# EAGLE design WDS_1554H_AALoRaANT3 (EAGLE 7.6.0)
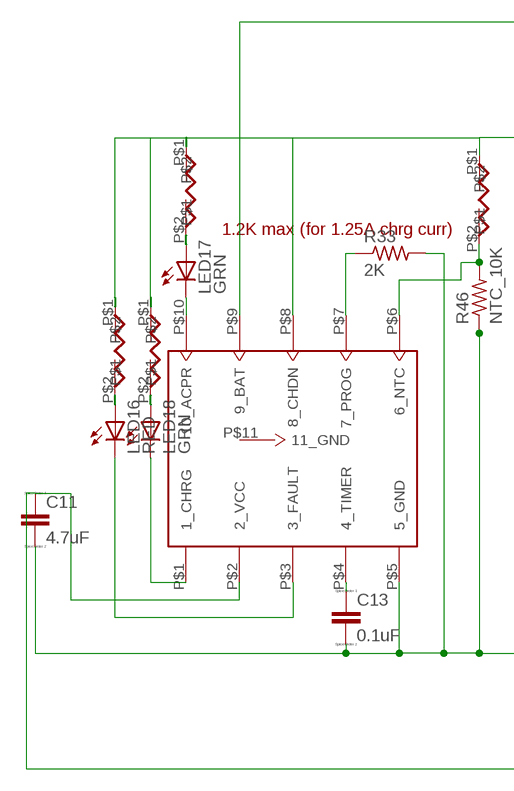
[diagram p0: schematic, sheet 1, part 1 of 2]
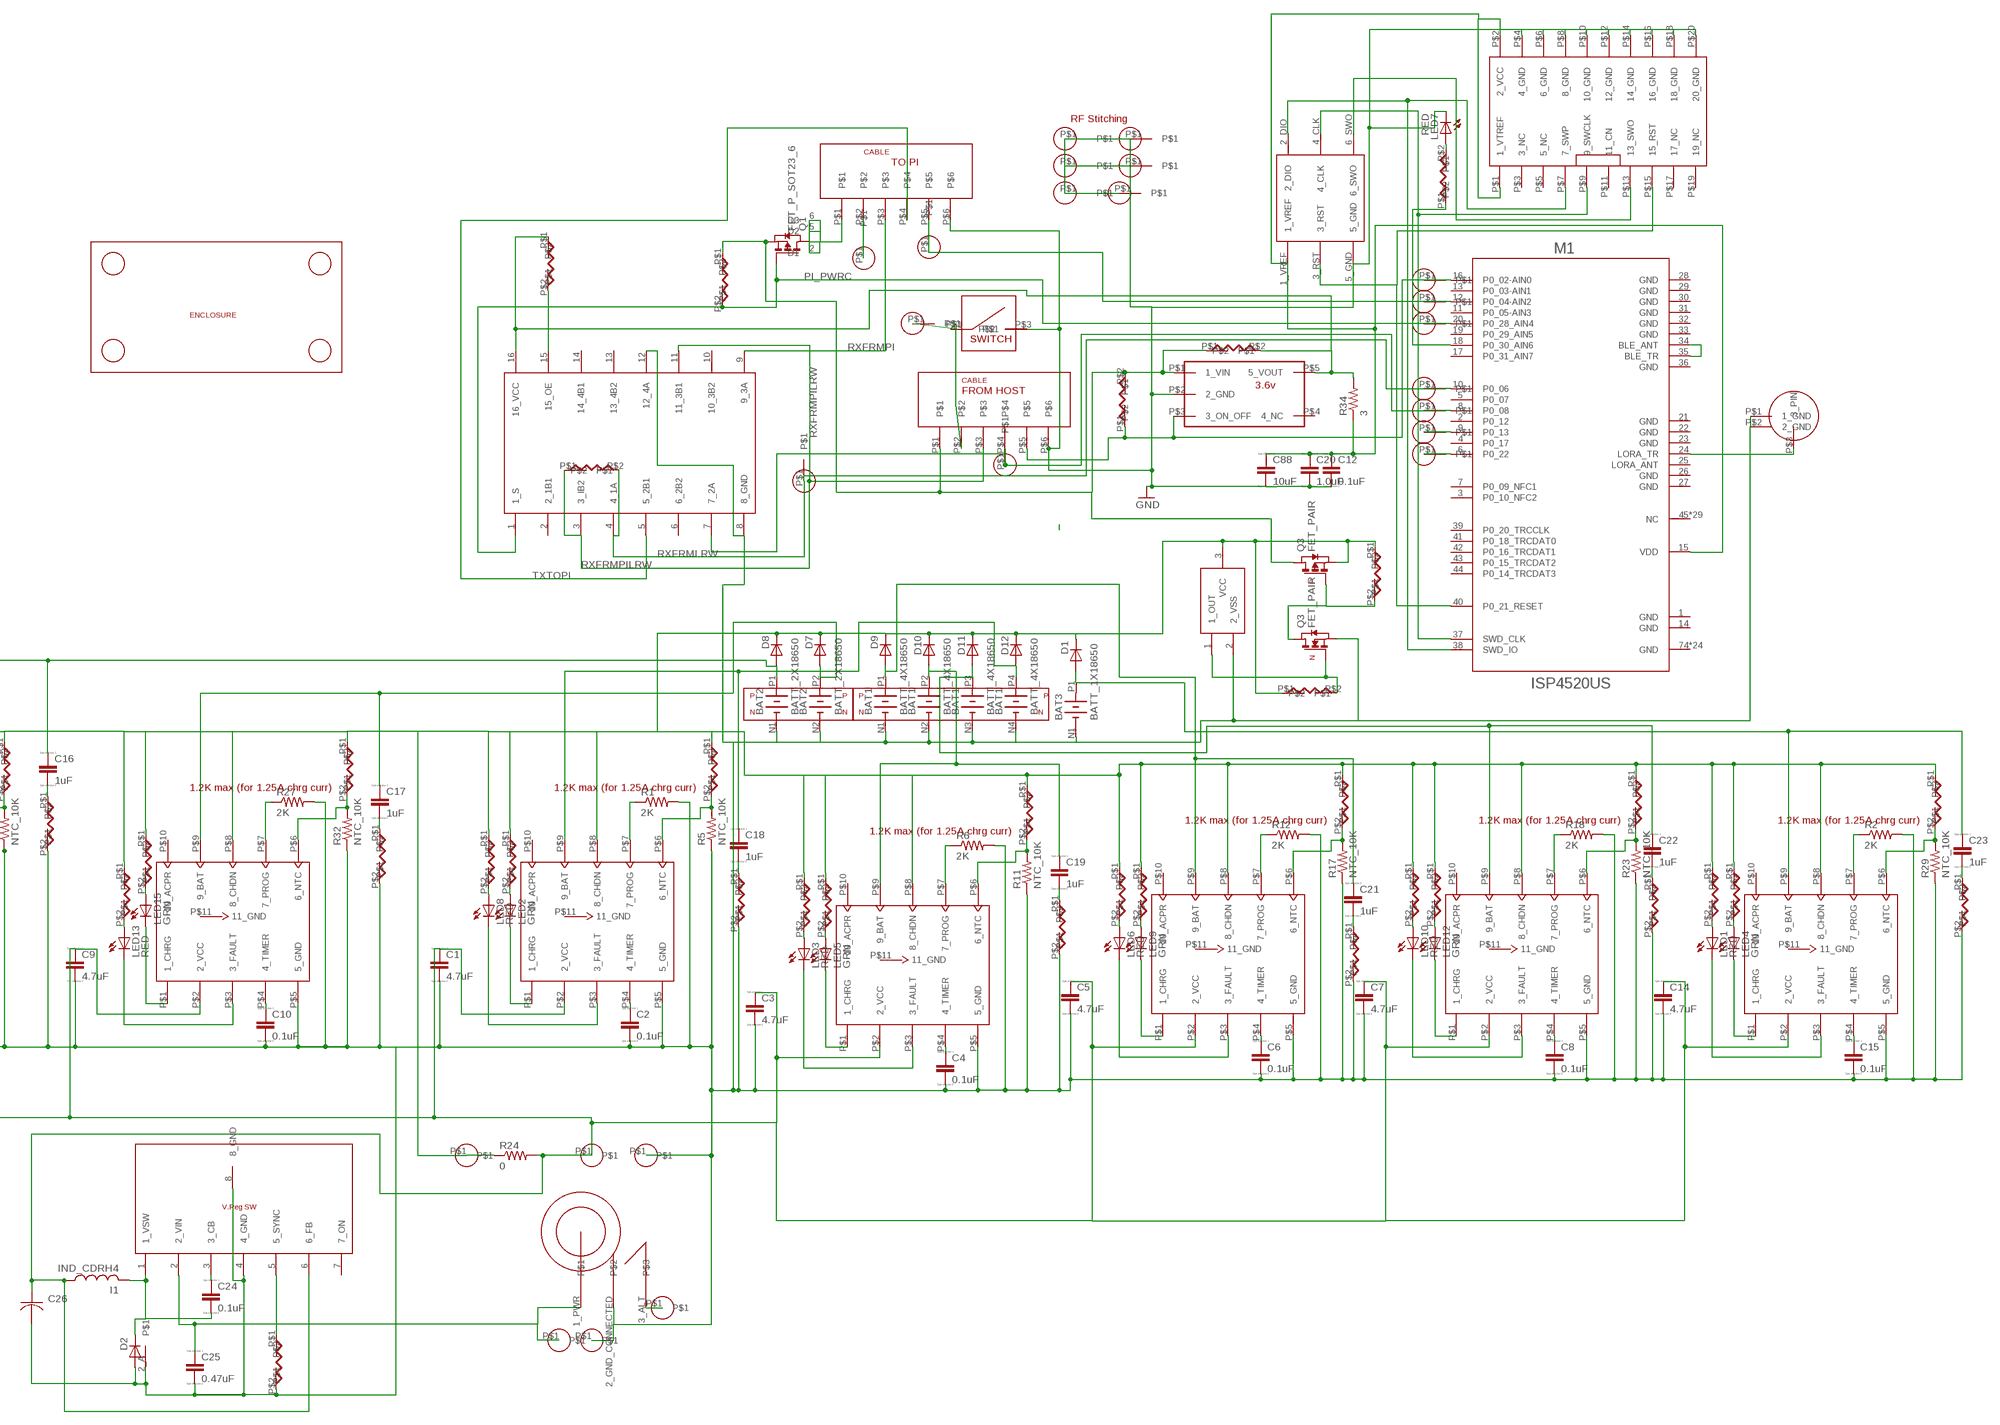
[diagram p1: schematic, sheet 1, part 2 of 2]

## Parts
BAT1  BATT_4X18650  [BATT_4X18650]
BAT2  BATT_2X18650  [BATT_2X18650]
BAT3  BATT_1X18650  [BATT_1X18650]
BOX1  ENCL_1554H  [ENCL_1554H]
C1  4.7uF  CAP_0603  [C0603]
C2  0.1uF  CAP_0402  [C0402]
C3  4.7uF  CAP_0603  [C0603]
C4  0.1uF  CAP_0402  [C0402]
C5  4.7uF  CAP_0603  [C0603]
C6  0.1uF  CAP_0402  [C0402]
C7  4.7uF  CAP_0603  [C0603]
C8  0.1uF  CAP_0402  [C0402]
C9  4.7uF  CAP_0603  [C0603]
C10  0.1uF  CAP_0402  [C0402]
C11  4.7uF  CAP_0603  [C0603]
C12  0.1uF  CAP_0402  [C0402]
C13  0.1uF  CAP_0402  [C0402]
C14  4.7uF  CAP_0603  [C0603]
C15  0.1uF  CAP_0402  [C0402]
C16  1uF  CAP_0603  [C0603]
C17  1uF  CAP_0603  [C0603]
C18  1uF  CAP_0603  [C0603]
C19  1uF  CAP_0603  [C0603]
C20  1.0uF  CAP_0603  [C0603]
C21  1uF  CAP_0603  [C0603]
C22  1uF  CAP_0603  [C0603]
C23  1uF  CAP_0603  [C0603]
C24  0.1uF  CAP_0402  [C0402]
C25  0.47uF  CAP_0402  [C0402]
C26  CAP_1210  [C1210K]
C88  10uF  CAP_0603  [C0603]
D1  DIODE_SCHTKY  [SOD323]
D2  DIODE_BIG  [DIODE_BIG]
D7  DIODE_SCHTKY  [SOD323]
D8  DIODE_SCHTKY  [SOD323]
D9  DIODE_SCHTKY  [SOD323]
D10  DIODE_SCHTKY  [SOD323]
D11  DIODE_SCHTKY  [SOD323]
D12  DIODE_SCHTKY  [SOD323]
G2  GPS_ANT  [GPS_ANTE]
I1  IND_CDRH4  [IND_CDRH4D]
J1  CONN_6P_VERT  [CONN_6PCABLE]
J2  HDR_JLINK  [HDR_JLINK]
J3  HDR_SEGER_6P  [HDR_SEGGER_6P]
J5  CONN_6P_VERT  [CONN_6PCABLE]
LED1  RED  LEDCHIP-LED0603  [CHIP-LED0603]
LED2  GRN  LEDCHIP-LED0603  [CHIP-LED0603]
LED3  RED  LEDCHIP-LED0603  [CHIP-LED0603]
LED4  GRN  LEDCHIP-LED0603  [CHIP-LED0603]
LED5  GRN  LEDCHIP-LED0603  [CHIP-LED0603]
LED6  RED  LEDCHIP-LED0603  [CHIP-LED0603]
LED7  RED  LEDCHIP-LED0603  [CHIP-LED0603]
LED8  RED  LEDCHIP-LED0603  [CHIP-LED0603]
LED9  GRN  LEDCHIP-LED0603  [CHIP-LED0603]
LED10  RED  LEDCHIP-LED0603  [CHIP-LED0603]
LED12  GRN  LEDCHIP-LED0603  [CHIP-LED0603]
LED13  RED  LEDCHIP-LED0603  [CHIP-LED0603]
LED15  GRN  LEDCHIP-LED0603  [CHIP-LED0603]
LED16  RED  LEDCHIP-LED0603  [CHIP-LED0603]
LED17  GRN  LEDCHIP-LED0603  [CHIP-LED0603]
LED18  GRN  LEDCHIP-LED0603  [CHIP-LED0603]
M1  ISP4520US  [ISP4520-LGA-QFN74-9.8X17.2X1.7MM]
Q1  FET_P_SOT23_6  [SOT23-6]
Q3  FET_PAIR  [SSOT6]
R1  2K  RES_0402  [SMD_0402]
R2  2K  RES_0402  [SMD_0402]
R3  1K  RES_0402  [SMD_0402]
R4  4k  RES_0402  [SMD_0402]
R5  NTC_10K  R-US_R0603  [R0603]
R6  2K  RES_0402  [SMD_0402]
R7  1K  RES_0402  [SMD_0402]
R8  1K  RES_0402  [SMD_0402]
R9  1K  RES_0402  [SMD_0402]
R10  4k  RES_0402  [SMD_0402]
R11  NTC_10K  R-US_R0603  [R0603]
R12  2K  RES_0402  [SMD_0402]
R13  1K  RES_0402  [SMD_0402]
R14  1K  RES_0402  [SMD_0402]
R15  1K  RES_0402  [SMD_0402]
R16  4k  RES_0402  [SMD_0402]
R17  NTC_10K  R-US_R0603  [R0603]
R18  2K  RES_0402  [SMD_0402]
R19  1K  RES_0402  [SMD_0402]
R20  4k  RES_0402  [SMD_0402]
R21  1K  RES_0402  [SMD_0402]
R22  4k  RES_0402  [SMD_0402]
R23  NTC_10K  R-US_R0603  [R0603]
R24  0  RES_0402  [SMD_0402]
R25  1M  RES_0402  [SMD_0402]
R26  1M  RES_0402  [SMD_0402]
R27  2K  RES_0402  [SMD_0402]
R28  1K  RES_0402  [SMD_0402]
R29  NTC_10K  R-US_R0603  [R0603]
R30  1K  RES_0402  [SMD_0402]
R31  4k  RES_0402  [SMD_0402]
R32  NTC_10K  R-US_R0603  [R0603]
R33  2K  RES_0402  [SMD_0402]
R34  3  R0402  [R0402]
R35  1K  RES_0402  [SMD_0402]
R36  1K  RES_0402  [SMD_0402]
R37  1K  RES_0402  [SMD_0402]
R38  4k  RES_0402  [SMD_0402]
R39  1ohm  RES_0402  [SMD_0402]
R40  DNS_0  RES_0402  [SMD_0402]
R41  DNS_100K  RES_0402  [SMD_0402]
R42  1M  RES_0402  [SMD_0402]
R43  1M  RES_0402  [SMD_0402]
R44  DNS_0  RES_0402  [SMD_0402]
R45  1K  RES_0402  [SMD_0402]
R46  NTC_10K  R-US_R0603  [R0603]
R47  1ohm  RES_0402  [SMD_0402]
R48  1ohm  RES_0402  [SMD_0402]
R49  1ohm  RES_0402  [SMD_0402]
R50  1ohm  RES_0402  [SMD_0402]
R51  1ohm  RES_0402  [SMD_0402]
R52  1ohm  RES_0402  [SMD_0402]
R53  1K  RES_0402  [SMD_0402]
R65  1K  RES_0402  [SMD_0402]
TP1  TP_26AWG  [TP_26AWG]
TP2  TP_THSM2  [TP_THSM2]
TP3  TP_THSM2  [TP_THSM2]
TP4  TP_THSM2  [TP_THSM2]
TP5  TP_THSM2  [TP_THSM2]
TP6  TP_26AWG  [TP_26AWG]
TP7  TP_26AWG  [TP_26AWG]
TP8  TP_26AWG  [TP_26AWG]
TP9  TP_26AWG  [TP_26AWG]
TP10  TP_26AWG  [TP_26AWG]
TP11  TP_26AWG  [TP_26AWG]
TP12  TP_26AWG  [TP_26AWG]
TP13  TP_26AWG  [TP_26AWG]
TP14  TP_THSM2  [TP_THSM2]
TP15  TP_26AWG  [TP_26AWG]
TP16  TP_26AWG  [TP_26AWG]
TP17  TP_26AWG  [TP_26AWG]
TP18  TP_26AWG  [TP_26AWG]
TP19  TP_26AWG  [TP_26AWG]
TP20  TP_26AWG  [TP_26AWG]
TP21  TP_26AWG  [TP_26AWG]
TP22  TP_26AWG  [TP_26AWG]
TP23  TP_26AWG  [TP_26AWG]
TP24  TP_THSM2  [TP_THSM2]
U1  LTC4053  [LTC4053]
U2  LTC4053  [LTC4053]
U3  LTC4053  [LTC4053]
U4  LTC4053  [LTC4053]
U5  LTC4053  [LTC4053]
U6  3.6v  VREG_23B  [SOT_235B]
U7  VOLT_SUPR  [TO236]
U8  LTC4053  [LTC4053]
U9  MUX_2X_1_2  [TSSOP16]
U10  LTC4053  [LTC4053]
U11  VREG_SW_LM2677  [TO263-7]
U$1  SWITCH  [SWITCH]
U$2  CONN_BARREL_SMHOLE  [CONN_JACK_VERT_SMHOLE]

## Nets
GND: BAT1.N1 BAT1.N2 BAT1.N3 BAT1.N4 BAT2.N1 BAT2.N2 BAT3.N1(-) C1.2 C2.2 C3.2 C4.2 C5.2 C6.2 C7.2 C8.2 C9.2 C10.2 C11.2 C12.2 C13.2 C14.2 C15.2 C20.2 C25.2 C26.2(2N) C88.2 D2.1_A(A) D2.2_A G2.P$1(1_GND) G2.P$2(2_GND) J1.P$6 J2.P$4(4_GND) J2.P$6(6_GND) J2.P$8(8_GND) J2.P$10(10_GND) J2.P$12(12_GND) J2.P$14(14_GND) J2.P$16(16_GND) J2.P$18(18_GND) J2.P$20(20_GND) J3.5_GND J5.P$6 LED7.C Q3.5(N_S) R1.P$2 R2.P$2 R5.1 R6.P$2 R11.1 R12.P$2 R17.1 R18.P$2 R23.1 R27.P$2 R29.1 R32.1 R33.P$2 R39.P$2 R46.1 R47.P$2 R48.P$2 R49.P$2 R50.P$2 R51.P$2 R52.P$2 R53.P$2 TP3.P$1 TP8.P$1 TP15.P$1 TP16.P$1 TP17.P$1 TP18.P$1 TP19.P$1 TP24.P$1 U1.P$5(5_GND) U2.P$5(5_GND) U3.P$5(5_GND) U4.P$5(5_GND) U5.P$5(5_GND) U6.P$2(2_GND) U7.2(2_VSS) U8.P$5(5_GND) U9.8(8_GND) U9.12(12_4A) U10.P$5(5_GND) U11.4(4_GND) U11.8(8_GND) U$1.P$3 U$2.2_GND_CONNECTED
LTE_RESET_X: J1.P$2 TP1.P$1 U$1.P$1
N$1: R53.P$1 U11.5(5_SYNC)
N$2: BAT1.P1 C21.1 D9.2_A(A) U4.P$9(9_BAT)
N$3: C15.1 U10.P$4(4_TIMER)
N$4: R2.P$1 U10.P$7(7_PROG)
N$5: LED1.A R8.P$2
N$7: J1.P$5 M1.16(P0_02-AIN0) R41.P$1 TP11.P$1 U6.P$3(3_ON_OFF)
N$8: Q3.1(N_G) R26.P$2 U7.1(1_OUT)
N$9: J1.P$1 Q1.4(S) Q3.4(P_D) R40.P$1 R41.P$2 R42.P$1 U6.P$1(1_VIN)
N$10: C24.1 U11.3(3_CB)
N$11: C16.2 R39.P$1
N$12: Q3.3(P_G) Q3.6(N_D) R25.P$2
N$13: BAT1.P2 C19.1 D10.2_A(A) U3.P$9(9_BAT)
N$14: BAT1.P4 C18.1 D12.2_A(A) U1.P$9(9_BAT)
N$15: C1.1 C3.1 C5.1 C7.1 C9.1 C11.1 C14.1 C26.1(1P) I1.P$3 R24.P$2 TP2.P$1 U1.P$2(2_VCC) U2.P$2(2_VCC) U3.P$2(2_VCC) U4.P$2(2_VCC) U5.P$2(2_VCC) U8.P$2(2_VCC) U10.P$2(2_VCC) U11.6(6_FB)
N$16: LED7.A R45.P$2
N$17: TP5.P$1 U$2.3_ALT
N$18: C2.1 U1.P$4(4_TIMER)
N$19: LED4.A R14.P$2
N$20: R1.P$1 U1.P$7(7_PROG)
N$21: LED2.A R3.P$2
N$22: LED4.C U10.P$1(1_CHRG)
N$23: LED2.C U1.P$1(1_CHRG)
N$24: LED8.C U1.P$3(3_FAULT)
N$25: R4.P$2 R5.2 U1.P$6(6_NTC)
N$26: BAT2.P2 C17.1 D7.2_A(A) U2.P$9(9_BAT)
N$27: LED1.C U10.P$3(3_FAULT)
N$28: C4.1 U3.P$4(4_TIMER)
N$29: R6.P$1 U3.P$7(7_PROG)
N$30: LED3.A R7.P$2
N$31: R20.P$2 R29.2 U10.P$6(6_NTC)
N$32: LED5.A R9.P$2
N$33: C17.2 R47.P$1
N$34: LED5.C U3.P$1(1_CHRG)
N$35: LED3.C U3.P$3(3_FAULT)
N$36: R10.P$2 R11.2 U3.P$6(6_NTC)
N$38: C10.1 U2.P$4(4_TIMER)
N$39: C6.1 U4.P$4(4_TIMER)
N$40: R12.P$1 U4.P$7(7_PROG)
N$41: LED6.A R13.P$2
N$42: BAT2.P1 C16.1 D8.2_A(A) U8.P$9(9_BAT)
N$43: LED9.A R15.P$2
N$44: C12.1 C20.1 C88.1 J2.P$1(1_VTREF) J2.P$2(2_VCC) J3.1_VREF M1.15(VDD) R34.1
N$45: LED9.C U4.P$1(1_CHRG)
N$46: LED6.C U4.P$3(3_FAULT)
N$47: R16.P$2 R17.2 U4.P$6(6_NTC)
N$48: R43.P$2 U9.15(15_OE)
N$49: R27.P$1 U2.P$7(7_PROG)
N$50: LED13.A R28.P$2
N$51: C8.1 U5.P$4(4_TIMER)
N$52: R18.P$1 U5.P$7(7_PROG)
N$53: LED10.A R19.P$2
N$54: C18.2 R48.P$1
N$55: LED12.A R21.P$2
N$56: C19.2 R49.P$1
N$57: LED12.C U5.P$1(1_CHRG)
N$58: LED10.C U5.P$3(3_FAULT)
N$59: R22.P$2 R23.2 U5.P$6(6_NTC)
N$60: J2.P$13(13_SWO) J3.6_SWO
N$61: LED15.A R30.P$2
N$63: LED15.C U2.P$1(1_CHRG)
N$64: LED13.C U2.P$3(3_FAULT)
N$65: R31.P$2 R32.2 U2.P$6(6_NTC)
N$66: C21.2 R50.P$1
N$67: BAT1.P3 C22.1 D11.2_A(A) U5.P$9(9_BAT)
N$68: C13.1 U8.P$4(4_TIMER)
N$69: R33.P$1 U8.P$7(7_PROG)
N$70: LED16.A R35.P$2
N$71: LED17.A R36.P$2
N$72: LED18.A R37.P$2
N$73: LED17.C U8.P$10(10_ACPR)
N$74: LED18.C U8.P$1(1_CHRG)
N$75: LED16.C U8.P$3(3_FAULT)
N$76: R38.P$2 R46.2 U8.P$6(6_NTC)
N$77: LED8.A R65.P$2
N$78: M1.34(BLE_ANT) M1.35(BLE_TR)
N$79: J2.P$15(15_RST) J3.3_RST M1.40(P0_21_RESET)
N$80: J2.P$7(7_SWP) J3.2_DIO M1.38(SWD_IO)
N$81: J2.P$9(9_SWCLK) J3.4_CLK M1.37(SWD_CLK)
N$82: J5.P$1 Q1.1(D) Q1.2(D1) Q1.5(D2) Q1.6(D3)
N$83: R34.2 R40.P$2 R43.P$1 U6.P$5(5_VOUT) U9.16(16_VCC)
N$84: C22.2 R51.P$1
N$85: G2.P$3(3_PIN) M1.24(LORA_TR)
N$86: M1.18(P0_30_AIN6) R45.P$1
N$87: J5.P$2 TP20.P$1
N$88: J5.P$5 M1.12(P0_04-AIN2) TP12.P$1 TP21.P$1
N$89: M1.9(P0_13) TP9.P$1
N$90: M1.6(P0_22) TP10.P$1
N$91: BAT3.P1(+) C23.1 D1.2_A(A) U10.P$9(9_BAT)
N$92: C23.2 R52.P$1
N$93: C24.2 D2.3_K(K) I1.P$4 U11.1(1_VSW)
N$95: C25.1 TP14.P$1 U11.2(2_VIN) U$2.1_PWR
PI_PWRC: M1.20(P0_28_AIN4) Q1.3(G) R42.P$2 TP13.P$1 U9.1(1_S)
RXFRMLRW: M1.10(P0_06) R44.P$2 TP6.P$1 TP22.P$1 U9.4(4_1A)
RXFRMPI: J5.P$3 U9.9(9_3A)
RXFRMPILRW: J1.P$3 R44.P$1 U9.3(3_IB2) U9.11(11_3B1)
TXTOLRW: J1.P$4 M1.8(P0_08) TP7.P$1 TP23.P$1 U9.7(7_2A)
TXTOPI: J5.P$4 U9.5(5_2B1)
VCC1: D1.1_K(K) D7.1_K(K) D8.1_K(K) D9.1_K(K) D10.1_K(K) D11.1_K(K) D12.1_K(K) Q3.2(P_S) R3.P$1 R4.P$1 R7.P$1 R8.P$1 R9.P$1 R10.P$1 R13.P$1 R14.P$1 R15.P$1 R16.P$1 R19.P$1 R20.P$1 R21.P$1 R22.P$1 R24.P$1 R25.P$1 R26.P$1 R28.P$1 R30.P$1 R31.P$1 R35.P$1 R36.P$1 R37.P$1 R38.P$1 R65.P$1 TP4.P$1 U1.P$8(8_CHDN) U2.P$8(8_CHDN) U3.P$8(8_CHDN) U4.P$8(8_CHDN) U5.P$8(8_CHDN) U7.3(VCC) U8.P$8(8_CHDN) U10.P$8(8_CHDN)
Unconnected: J2.P$3(3_NC) J2.P$5(5_NC) J2.P$11(11_CN) J2.P$17(17_NC) J2.P$19(19_NC) M1.2(P0_12) M1.3(P0_10_NFC2) M1.4(P0_17) M1.5(P0_07) M1.7(P0_09_NFC1) M1.11(P0_05-AIN3) M1.13(P0_03-AIN1) M1.17(P0_31_AIN7) M1.19(P0_29_AIN5) M1.39(P0_20_TRCCLK) M1.41(P0_18_TRCDAT0) M1.42(P0_16_TRCDAT1) M1.43(P0_15_TRCDAT2) M1.44(P0_14_TRCDAT3) M1.45(NC) M1.46(NC) M1.47(NC) M1.48(NC) M1.49(NC) M1.50(NC) M1.51(NC) M1.52(NC) M1.53(NC) M1.54(NC) M1.55(NC) M1.56(NC) M1.57(NC) M1.58(NC) M1.59(NC) M1.60(NC) M1.61(NC) M1.62(NC) M1.63(NC) M1.64(NC) M1.65(NC) M1.66(NC) M1.67(NC) M1.68(NC) M1.69(NC) M1.70(NC) M1.71(NC) M1.72(NC) M1.73(NC) U1.P$10(10_ACPR) U1.P$11(11_GND) U2.P$10(10_ACPR) U2.P$11(11_GND) U3.P$10(10_ACPR) U3.P$11(11_GND) U4.P$10(10_ACPR) U4.P$11(11_GND) U5.P$10(10_ACPR) U5.P$11(11_GND) U6.P$4(4_NC) U8.P$11(11_GND) U9.2(2_1B1) U9.6(6_2B2) U9.10(10_3B2) U9.13(13_4B2) U9.14(14_4B1) U10.P$10(10_ACPR) U10.P$11(11_GND) U11.7(7_ON)

## Notes on the sheet
- RF Stitching
- TO PI
- 3.6v
- FROM HOST
- 1.2K max (for 1.25A chrg curr) | 1.2K max (for 1.25A chrg curr) | 1.2K max (for 1.25A chrg curr)
- 1.2K max (for 1.25A chrg curr) | 1.2K max (for 1.25A chrg curr) | 1.2K max (for 1.25A chrg curr)
- 1.2K max (for 1.25A chrg curr)

## Power pins joined to a net without a drawn wire
GND: M1.1(GND) M1.14(GND) M1.21(GND) M1.22(GND) M1.23(GND) M1.26(GND) M1.27(GND) M1.28(GND) M1.29(GND) M1.30(GND) M1.31(GND) M1.32(GND) M1.33(GND) M1.36(GND) M1.74(GND) M1.75(GND) M1.76(GND) M1.77(GND) M1.78(GND) M1.79(GND) M1.80(GND) M1.81(GND) M1.82(GND) M1.83(GND) M1.84(GND) M1.85(GND) M1.86(GND) M1.87(GND) M1.88(GND) M1.89(GND) M1.90(GND) M1.91(GND) M1.92(GND) M1.93(GND) M1.94(GND) M1.95(GND) M1.96(GND) M1.97(GND)
LORA_ANT: M1.25(LORA_ANT)

## Library data of the parts
BAT1 = BBox02:BATT_4X18650
BAT2 = BBox02:BATT_2X18650
BAT3 = BBox02:BATT_1X18650
BOX1 = BBox02:ENCL_1554H
C1 C3 C5 C7 C9 C11 C14 C16-C23 C88 = BBox02:CAP_0603
C2 C4 C6 C8 C10 C13 C15 C24 C25 = BBox02:CAP_0402
C12 = BBox01:CAP_0402
C26 = BBox02:CAP_1210
D1 D7-D12 = BBox02:DIODE_SCHTKY
D2 = BBox02:DIODE_BIG
G2 = HO2:GPS_ANT
I1 = BBox02:IND_CDRH4
J1 J5 = BBox02:CONN_6P_VERT
J2 = BBox02:HDR_JLINK
J3 = BBox02:HDR_SEGER_6P
LED1-LED10 LED12 LED13 LED15-LED18 = led:LED: LED OSRAM: - CHIPLED LG R971, LG N971, LY N971, LG Q971, LY Q971, LO R971, LY R971 LH N974, LH R974 LS Q976, LO Q976, LY Q976 LO Q996 - Hyper CHIPLED LW Q18S LB Q993, LB Q99A, LB R99A - SideLED LS A670, LO A670, LY A670, LG A670, LP A670 LB A673, LV A673, LT A673, LW A673 LH A674 LY A675 LS A676, LA A676, LO A676, LY A676, LW A676 LS A679, LY A679, LG A679 - Hyper Micro SIDELED® LS Y876, LA Y876, LO Y876, LY Y876 LT Y87S - SmartLED LW L88C, LW L88S LB L89C, LB L89S, LG L890 LS L89K, LO L89K, LY L89K LS L896, LA L896, LO L896, LY L896 - TOPLED LS T670, LO T670, LY T670, LG T670, LP T670 LSG T670, LSP T670, LSY T670, LOP T670, LYG T670 LG T671, LOG T671, LSG T671 LB T673, LV T673, LT T673, LW T673 LH T674 LS T676, LA T676, LO T676, LY T676, LB T676, LH T676, LSB T676, LW T676 LB T67C, LV T67C, LT T67C, LS T67K, LO T67K, LY T67K, LW E67C LS E67B, LA E67B, LO E67B, LY E67B, LB E67C, LV E67C, LT E67C LW T67C LS T679, LY T679, LG T679 LS T770, LO T770, LY T770, LG T770, LP T770 LB T773, LV T773, LT T773, LW T773 LH T774 LS E675, LA E675, LY E675, LS T675 LS T776, LA T776, LO T776, LY T776, LB T776 LHGB T686 LT T68C, LB T68C - Hyper Mini TOPLED® LB M676 - Mini TOPLED Santana® LG M470 LS M47K, LO M47K, LY M47K Source: http://www.osram.convergy.de LUXEON: - LUMILED® LXK2-PW12-R00, LXK2-PW12-S00, LXK2-PW14-U00, LXK2-PW14-V00 LXK2-PM12-R00, LXK2-PM12-S00, LXK2-PM14-U00 LXK2-PE12-Q00, LXK2-PE12-R00, LXK2-PE12-S00, LXK2-PE14-T00, LXK2-PE14-U00 LXK2-PB12-K00, LXK2-PB12-L00, LXK2-PB12-M00, LXK2-PB14-N00, LXK2-PB14-P00, LXK2-PB14-Q00 LXK2-PR12-L00, LXK2-PR12-M00, LXK2-PR14-Q00, LXK2-PR14-R00 LXK2-PD12-Q00, LXK2-PD12-R00, LXK2-PD12-S00 LXK2-PH12-R00, LXK2-PH12-S00 LXK2-PL12-P00, LXK2-PL12-Q00, LXK2-PL12-R00 Source: www.luxeon.com KINGBRIGHT: KA-3528ASYC Source: www.kingbright.com
M1 = InSight_SiP_ISP4520xx:ISP4520*: ISP4520 Combined BLE and LoRa Module Based on the Nordic nRF52832 Bluetooth Low Energy Chip and Semtech SX126x LoRa Transceiver together with Integrated Antennas, matching networks, crystals, DC/DC power supply, NFC and 512kByte Flash and 64kByte SRAM DATASHEET ISP4520xx <https://www.insightsip.com/fichiers_insightsip/pdf/ble/ISP4520/isp_lora_DS4520.pdf>
Q1 = BBox02:FET_P_SOT23_6
Q3 = BBox02:FET_PAIR
R1 R2 R6 R12 R18 R24 R27 R33 = BBox02:RES_0402
R3 R4 R7-R10 R13-R16 R19-R22 R25 R26 R28 R30 R31 R35-R45 R47-R53 R65 = HO2:RES_0402
R5 R11 R17 R23 R29 R32 R46 = resistor:R-US_: RESISTOR, American symbol
R34 = BBox01:R0402
TP1 TP6-TP13 TP15-TP23 = BBox02:TP_26AWG
TP2-TP5 TP14 TP24 = BBox02:TP_THSM2
U1-U5 U8 U10 = BBox02:LTC4053
U6 = HO2:VREG_23B
U7 = BBox02:VOLT_SUPR
U9 = BBox02:MUX_2X_1_2
U11 = BBox02:VREG_SW_LM2677
U$1 = HO3:SWITCH
U$2 = BBox02:CONN_BARREL_SMHOLE

## Board
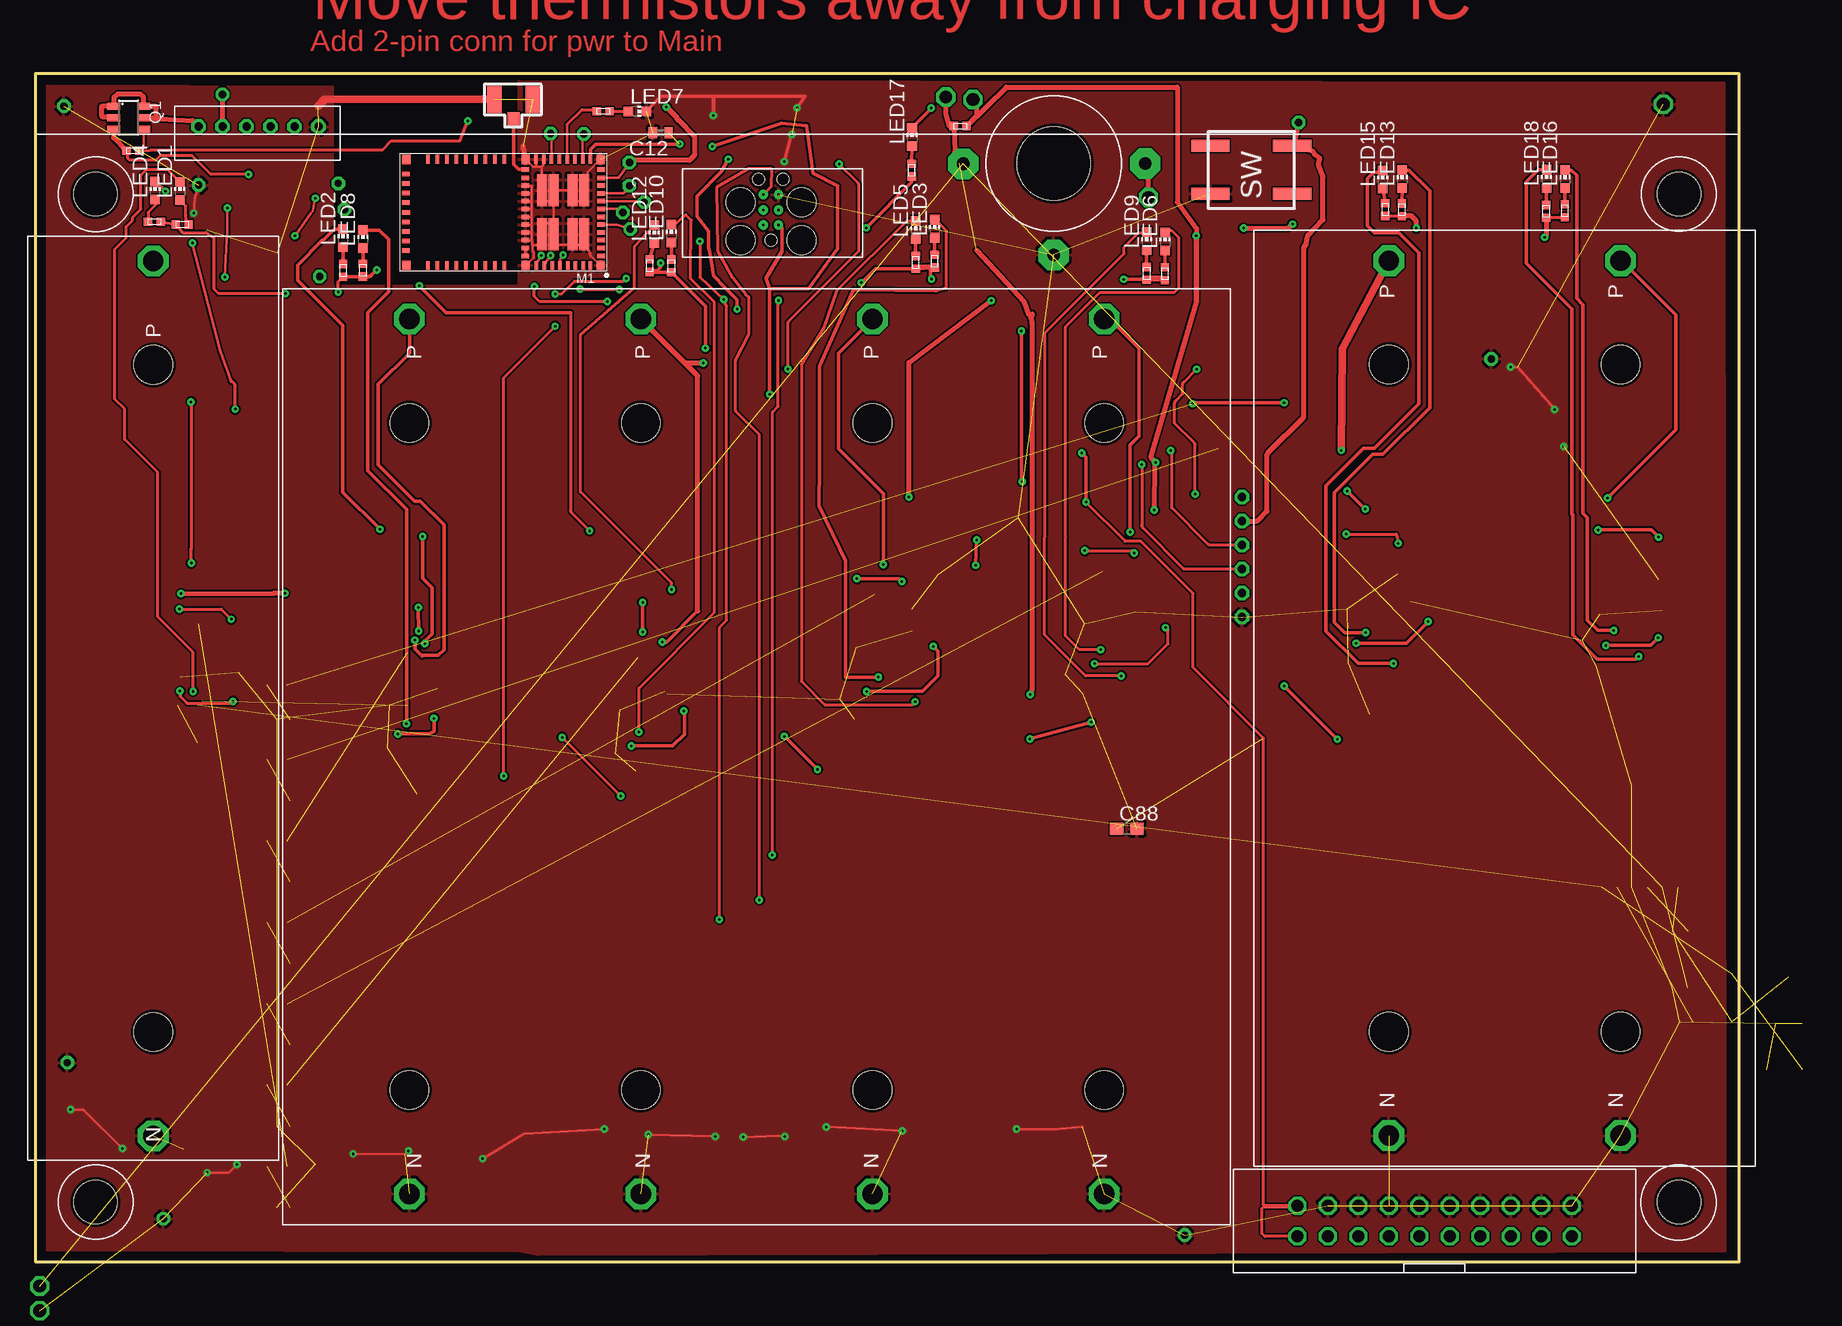
[diagram p2: board, top side]
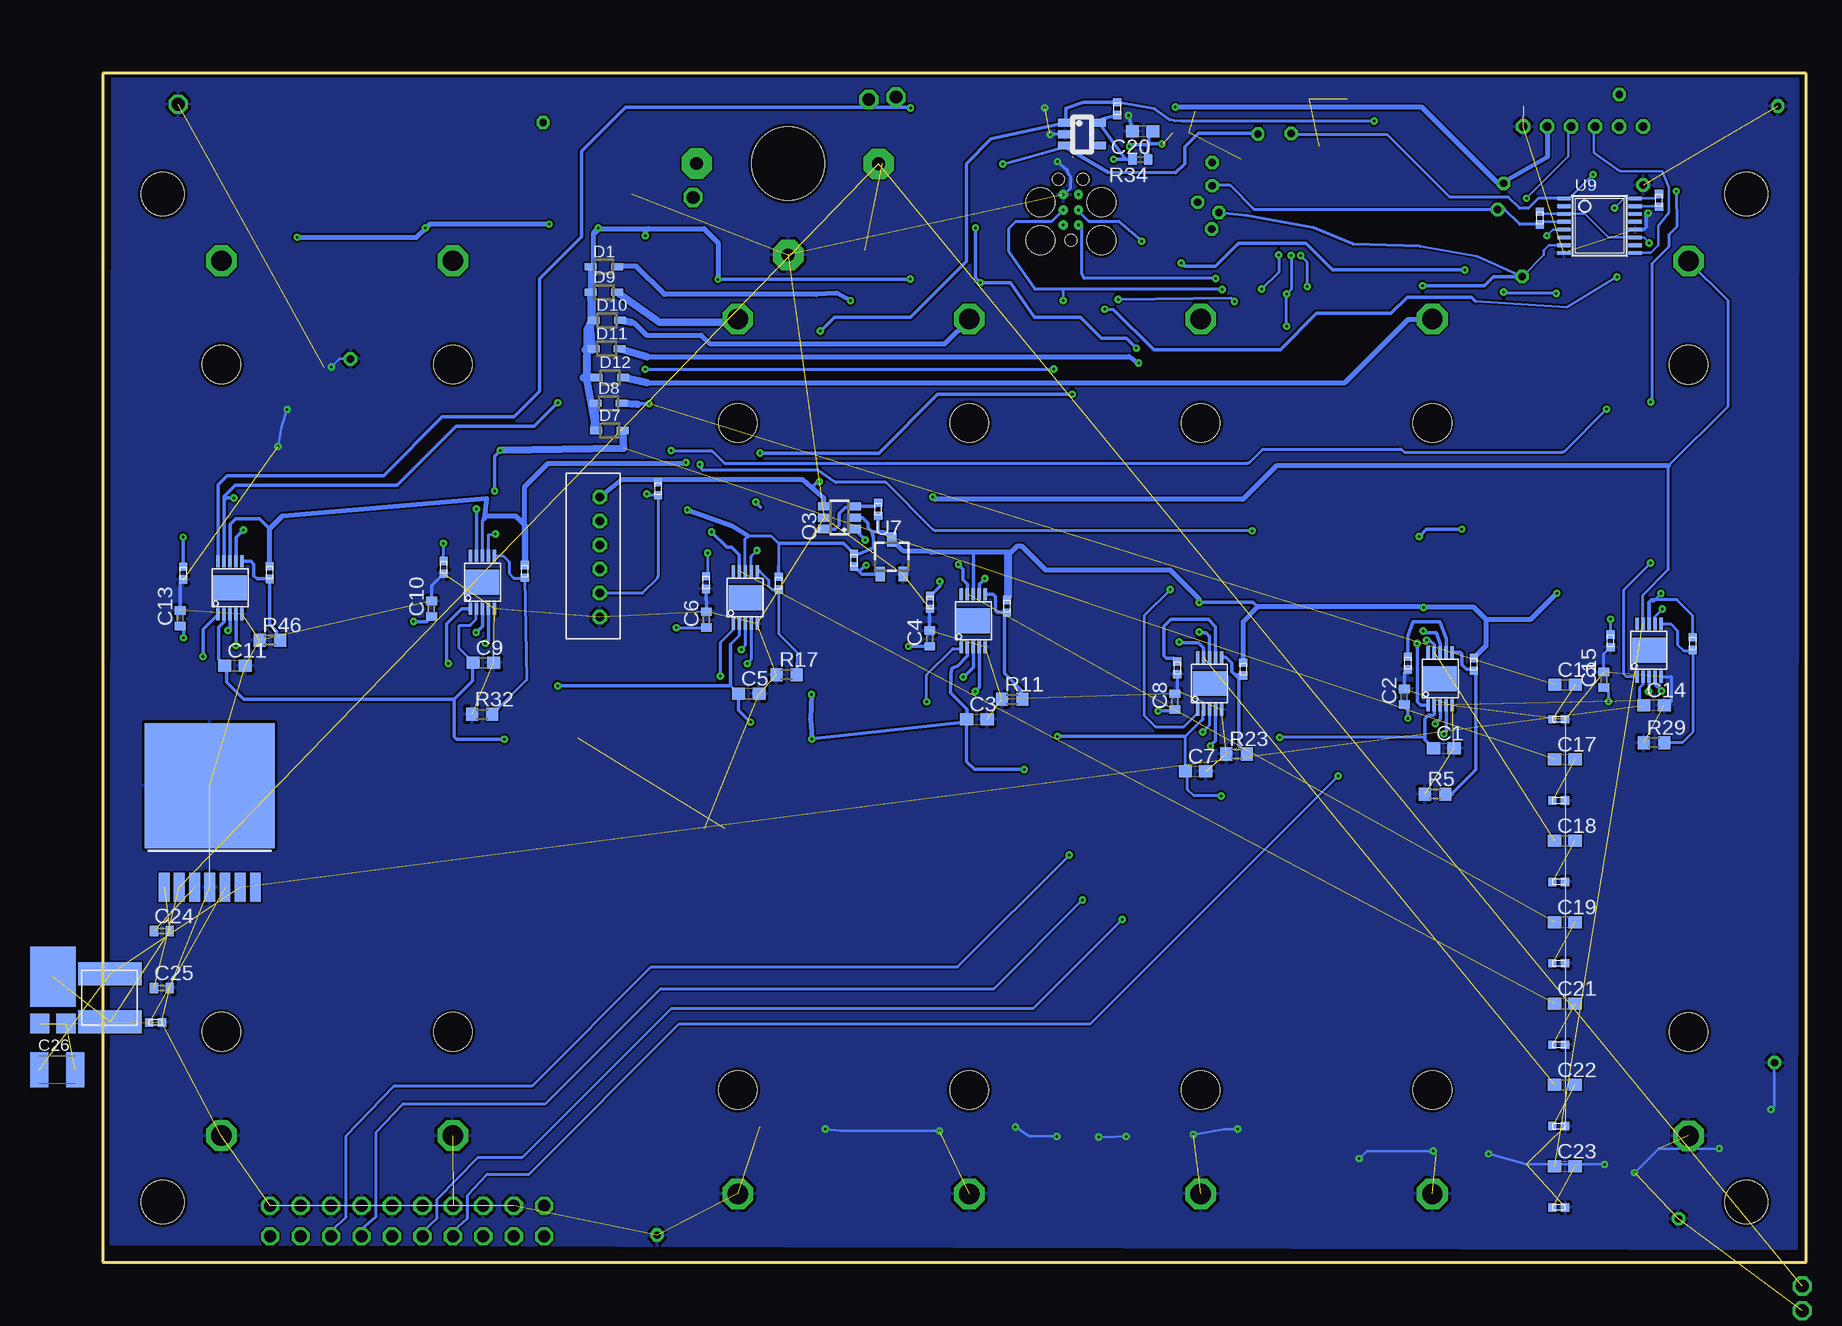
[diagram p3: board, bottom side, seen from below]

Size 141.99 x 99.06 mm. Coordinates in mm from the lower left corner, seen from the top.
Outline: 0,0 0,99.06 141.99,99.06 141.99,0 0,0
Copper layers (1*16): Top 0.035mm / dielectric 1.5mm / Bottom 0.035mm
Design rules "default *": minimum track width 6mil, minimum drill 8mil, track to track 6mil, track to pad 6mil, pad to pad 6mil, via to via 6mil, smd to smd 6mil, copper to edge 10mil, drill to drill 8mil, minimum pad ring 10mil, minimum via ring 8mil, stop-mask expansion 4mil, vias tented up to drill 0mil, thermal gap 10mil

### Footprints (pad centres in the part's own frame; a part is rotated, then mirrored left to right if it is on the bottom)
BATT_4X18650 = drill 1.7 octagon: N1 36.45,28.95; N2 36.45,9.65; N3 36.45,-9.65; N4 36.45,-28.95; P1 -36.45,28.95; P2 -36.45,9.65; P3 -36.45,-9.65; P4 -36.45,-28.95 | hole 3.2: -27.805,28.95; 27.805,28.95; -27.805,9.65; 27.805,9.65; -27.805,-9.65; 27.805,-9.65; -27.805,-28.95; 27.805,-28.95
BATT_2X18650 = drill 1.7 octagon: N1 36.45,9.65; N2 36.45,-9.65; P1 -36.45,9.65; P2 -36.45,-9.65 | hole 3.2: -27.805,9.65; 27.805,9.65; -27.805,-9.65; 27.805,-9.65
BATT_1X18650 = drill 1.7 octagon: N1 36.45,0; P1 -36.45,0 | hole 3.2: -27.805,0; 27.805,0
ENCL_1554H = hole 3.6: -66,42; 66,42; 66,-42; -66,-42
C0603 = smd 1.1 x 1: 1 -0.85,0; 2 0.85,0
C0402 = smd 0.7 x 0.9: 1 -0.65,0; 2 0.65,0
C1210K = smd 1.5 x 2.9: 1 -1.5,0; 2 1.5,0
SOD323 = smd 1 x 0.6: 1_K -1.1,0; 2_A 1.1,0
DIODE_BIG = smd 1.6 x 1.6: 1_A -1.1,-3.9; 2_A 1.1,-3.9 | smd 3.8 x 5: 3_K 0,0
GPS_ANTE = smd 2.2 x 1.2: P$1 0,-1.6; P$2 0,1.6 | smd 1.1 x 1: P$3 1.6,0
IND_CDRH4D = smd 5.3 x 1.9: P$3 0,2; P$4 0,-2
CONN_6PCABLE = drill 0.7 octagon: P$1 0,0; P$2 2,0; P$3 4,0; P$4 6,0; P$5 8,0; P$6 10,0
HDR_JLINK = drill 1 octagon: P$1 -10.16,0; P$2 -10.16,2.54; P$3 -7.62,0; P$4 -7.62,2.54; P$5 -5.08,0; P$6 -5.08,2.54; P$7 -2.54,0; P$8 -2.54,2.54; P$9 0,0; P$10 0,2.54; P$11 2.54,0; P$12 2.54,2.54; P$13 5.08,0; P$14 5.08,2.54; P$15 7.62,0; P$16 7.62,2.54; P$17 10.16,0; P$18 10.16,2.54; P$19 12.7,0; P$20 12.7,2.54
HDR_SEGGER_6P = drill 0.203 pad 0.787: 1_VREF 1.27,-0.635; 2_DIO 1.27,0.635; 3_RST 2.54,-0.635; 4_CLK 2.54,0.635; 5_GND 3.81,-0.635; 6_SWO 3.81,0.635 | hole 0.991: 0,0; 5.08,-1.016; 5.08,1.016 | hole 2.388: 0,2.54; 0,-2.54; 3.175,2.54; 3.175,-2.54
CHIP-LED0603 = smd 0.8 x 0.8: A 0,-0.75; C 0,0.75
ISP4520-LGA-QFN74-9.8X17.2X1.7MM = smd 0.7 x 0.7: 1 0.5,9.3; 14 0.5,0.5; 23 6.75,0.5; 36 6.75,9.3; 54 16.7,0.5; 64 16.7,9.3 | smd 0.65 x 0.3: 2 0.475,8.525; 3 0.475,7.875; 4 0.475,7.225; 5 0.475,6.575; 6 0.475,5.925; 7 0.475,5.275; 8 0.475,4.625; 9 0.475,3.975; 10 0.475,3.325; 11 0.475,2.675; 12 0.475,2.025; 13 0.475,1.325; 24 6.775,1.325; 25 6.775,2.025; 26 6.775,2.675; 27 6.775,3.325; 28 6.775,3.975; 29 6.775,4.625; 30 6.775,5.275; 31 6.775,5.925; 32 6.775,6.575; 33 6.775,7.225; 34 6.775,7.875; 35 6.775,8.525; 55 16.73,1.7; 56 16.73,2.5; 57 16.73,3.3; 58 16.73,4.1; 59 16.725,4.9; 60 16.73,5.7; 61 16.73,6.5; 62 16.73,7.3; 63 16.73,8.1 | smd 0.3 x 0.65: 15 1.35,0.475; 16 2,0.475; 17 2.65,0.475; 18 3.3,0.475; 19 3.95,0.475; 20 4.6,0.475; 21 5.25,0.475; 22 5.9,0.475; 37 5.85,9.325; 38 5.2,9.325; 39 4.55,9.325; 40 3.9,9.325; 41 3.25,9.325; 42 2.6,9.325; 43 1.95,9.325; 44 1.35,9.325; 45 8.525,0.475; 46 9.325,0.475; 47 10.125,0.475; 48 10.925,0.475; 49 11.725,0.475; 50 12.525,0.475; 51 13.325,0.475; 52 14.125,0.475; 53 14.925,0.475; 65 14.925,9.325; 66 14.125,9.325; 67 13.325,9.325; 68 12.525,9.325; 69 11.725,9.325; 70 10.925,9.325; 71 10.125,9.325; 72 9.325,9.325; 73 8.525,9.325 | smd 0.85 x 0.8: 74 1.88,5.825; 75 4.425,5.825; 76 1.88,2.175; 77 4.425,2.175; 78 1.88,6.725; 79 1.88,7.625; 80 2.83,5.825; 81 2.83,6.725; 82 2.83,7.625; 83 4.43,6.725; 84 4.43,7.625; 85 5.38,5.825; 86 5.38,6.725; 87 5.38,7.625; 88 1.88,3.075; 89 1.88,3.975; 90 2.83,2.175; 91 2.83,3.075; 92 2.83,3.975; 93 4.43,3.075; 94 4.43,3.975; 95 5.38,2.175; 96 5.38,3.075; 97 5.38,3.975
SOT23-6 = smd 0.6 x 1.1: 1 -0.95,-1.25; 2 0,-1.25; 3 0.95,-1.25; 4 0.95,1.25; 5 0,1.25; 6 -0.95,1.25
SSOT6 = smd 0.69 x 0.99: 1 -0.95,-1.3; 2 0,-1.3; 3 0.95,-1.3; 4 0.95,1.3; 5 0,1.3; 6 -0.95,1.3
SMD_0402 = smd 0.686 x 0.686: P$1 -0.533,0; P$2 0.533,0
R0603 = smd 1 x 1.1: 1 -0.85,0; 2 0.85,0
R0402 = smd 0.7 x 0.9: 1 -0.65,0; 2 0.65,0
TP_26AWG = drill 0.61 octagon: P$1 0,0
TP_THSM2 = drill 1.067 pad 1.524 octagon: P$1 0,0
LTC4053 = smd 0.29 x 1: P$1 -1,-2.2; P$2 -0.5,-2.2; P$3 0,-2.2; P$4 0.5,-2.2; P$5 1,-2.2; P$6 1,2.2; P$7 0.5,2.2; P$8 0,2.2; P$9 -0.5,2.2; P$10 -1,2.2 | smd 2.8 x 2.08: P$11 0,0
SOT_235B = smd 0.65 x 1.2: P$1 -0.95,-1.4; P$2 0,-1.4; P$3 0.95,-1.4; P$4 0.95,1.4; P$5 -0.95,1.4
TO236 = smd 0.8 x 1.2: 1 -0.95,-1.45; 2 0.95,-1.45; 3 0,1.45
TSSOP16 = smd 0.305 x 1.118: 1 -2.275,-2.969; 2 -1.625,-2.969; 3 -0.975,-2.969; 4 -0.325,-2.969; 5 0.325,-2.969; 6 0.975,-2.969; 7 1.625,-2.969; 8 2.275,-2.969; 9 2.275,2.969; 10 1.625,2.969; 11 0.975,2.969; 12 0.325,2.969; 13 -0.325,2.969; 14 -0.975,2.969; 15 -1.625,2.969; 16 -2.275,2.969
TO263-7 = smd 0.914 x 2.413: 1 -3.81,-8.458; 2 -2.54,-8.458; 3 -1.27,-8.458; 4 0,-8.458; 5 1.27,-8.458; 6 2.54,-8.458; 7 3.81,-8.458 | smd 10.8 x 10.41: 8 0,0
SWITCH = smd 1 x 3.2: P$1 -2,3.4; P$2 -2,-3.4; P$3 2,-3.4; P$4 2,3.4
CONN_JACK_VERT_SMHOLE = drill 1.067 pad 2.54 octagon: 1_PWR -7.544,-0.025; 2_GND_CONNECTED 0,-7.62; 3_ALT 7.62,0 | hole 6.096: 0,0

### Placement (x,y rotation side)
BAT1  60.11,42.12 270 top
BAT2  122.45,46.99 270 top
BAT3  9.8,46.96 270 top
BOX1  70.99,46.99 0 top
C1  30.2,42.81 0 bottom
C2  33.5,47.11 90 bottom
C3  69.12,45.23 0 bottom
C4  73.05,51.96 90 bottom
C5  88.14,47.37 0 bottom
C6  91.67,53.54 90 bottom
C7  50.9,40.89 0 bottom
C8  52.62,46.71 90 bottom
C9  110.26,49.94 0 bottom
C10  114.58,54.43 90 bottom
C11  130.96,49.71 0 bottom
C12  52.11,94.1 180 top
C13  135.53,53.64 90 bottom
C14  12.67,46.41 0 bottom
C15  16.87,48.51 90 bottom
C16  20.09,48.11 0 bottom
C17  20.12,41.88 0 bottom
C18  20.12,35.1 0 bottom
C19  20.12,28.32 0 bottom
C20  55.3,94.22 180 bottom
C21  20.12,21.54 0 bottom
C22  20.12,14.76 0 bottom
C23  20.12,7.98 0 bottom
C24  137.06,27.58 0 bottom
C25  137.06,22.83 0 bottom
C26  145.8,16.03 0 bottom
C88  90.96,36.12 0 top
D1  100.23,82.93 0 bottom
D2  146.15,23.77 0 bottom  (outside the outline)
D7  99.75,69.29 0 bottom
D8  99.82,71.55 0 bottom
D9  100.21,80.81 0 bottom
D10  99.96,78.48 0 bottom
D11  99.99,76.1 0 bottom
D12  99.71,73.71 0 bottom
G2  39.83,96.88 270 top
I1  141.38,22.02 0 bottom
J1  100.55,63.73 270 bottom
J2  115.34,2.13 0 top
J3  61.29,85.14 90 top
J5  13.59,94.61 0 top
LED1  12.01,89.26 0 top
LED2  25.63,85.33 0 top
LED3  74.94,86.1 0 top
LED4  9.96,89.28 0 top
LED5  73.36,86 0 top
LED6  94.14,85.06 0 top
LED7  50.16,95.89 270 top
LED8  27.28,85.25 0 top
LED9  92.61,85.08 0 top
LED10  52.99,85.71 0 top
LED12  51.56,85.66 0 top
LED13  113.92,90.25 0 top
LED15  112.29,90.22 0 top
LED16  127.48,90.25 0 top
LED17  73.05,93.75 0 top
LED18  125.93,90.27 0 top
M1  47.6,92.38 180 top
Q1  7.75,95.35 270 top
Q3  80.57,62.03 90 bottom
R1  33.2,49.91 270 bottom
R2  16.31,51.77 270 bottom
R3  25.63,82.63 90 top
R4  27.7,49.81 270 bottom
R5  30.94,38.99 0 bottom
R6  73.03,54.96 270 bottom
R7  74.94,83.4 90 top
R8  12.22,86.46 0 top
R9  73.36,83.3 90 top
R10  66.62,54.63 270 bottom
R11  66.19,46.89 0 bottom
R12  91.7,56.62 270 bottom
R13  94.14,82.36 90 top
R14  9.91,86.69 180 top
R15  92.61,82.38 90 top
R16  85.64,56.57 270 bottom
R17  84.99,48.95 0 bottom
R18  52.42,49.51 270 bottom
R19  52.99,83.01 90 top
R20  9.45,51.54 270 bottom
R21  51.18,83.03 90 top
R22  46.92,49.41 270 bottom
R23  47.47,42.34 0 bottom
R24  77.06,94.66 180 top
R25  77.35,62.73 90 bottom
R26  79.35,58.49 270 bottom
R27  113.56,57.89 270 bottom
R28  113.89,87.68 90 top
R29  12.67,43.28 0 bottom
R30  112.5,87.71 90 top
R31  106.81,57.56 270 bottom
R32  110.36,45.64 0 bottom
R33  135.28,57.4 270 bottom
R34  55.5,91.88 180 bottom
R35  127.46,87.6 90 top
R36  73.03,90.98 90 top
R37  125.91,87.55 90 top
R38  128.07,57.45 270 bottom
R39  20.62,45.24 0 bottom
R40  57.43,96.11 270 bottom
R41  95.71,64.44 90 bottom
R42  8.1,92.61 180 top
R43  12.27,88.47 270 bottom
R44  22.2,87 270 bottom
R45  47.32,95.89 0 top
R46  128.07,51.82 0 bottom
R47  20.62,38.46 0 bottom
R48  20.62,31.67 0 bottom
R49  20.62,24.89 0 bottom
R50  20.62,18.11 0 bottom
R51  20.62,11.33 0 bottom
R52  20.62,4.55 0 bottom
R53  137.59,19.96 0 bottom
R65  27.28,82.66 90 top
TP1  105.28,94.95 0 top
TP2  75.87,97.08 0 top
TP3  135.69,96.48 0 top
TP4  78.13,96.87 0 top
TP5  92.77,88.72 0 top
TP6  49.5,89.69 180 top
TP7  48.95,87.45 180 top
TP8  95.78,2.24 0 top
TP9  50.72,88.32 180 top
TP10  49.56,86.08 180 top
TP11  45.69,94.01 180 top
TP12  49.5,91.62 180 top
TP13  42.93,94.03 180 top
TP14  0.33,-2.01 0 top
TP15  121.34,75.26 0 top
TP16  10.64,3.61 0 top
TP17  13.59,89.74 0 top
TP18  2.36,96.32 0 top
TP19  2.64,16.61 0 top
TP20  15.57,97.28 270 top
TP21  25.22,89.89 0 top
TP22  25.73,87.71 270 top
TP23  23.67,82.12 270 top
TP24  0.33,-4.06 0 top  (outside the outline)
U1  30.5,48.61 0 bottom
U2  110.34,56.64 0 bottom
U3  69.42,53.43 0 bottom
U4  88.44,55.37 0 bottom
U5  49.72,48.21 0 bottom
U6  60.34,93.98 270 bottom
U7  76.22,58.77 0 bottom
U8  131.37,56.18 0 bottom
U9  17.22,86.36 270 bottom
U10  13.11,50.98 0 bottom
U11  133.07,39.7 0 bottom
U$1  101.33,91.01 270 top
U$2  84.86,91.54 0 top

### Tracks (layer width: path | path; a pad name or v marks a point on that pad's centre or on a via)
GND  (via drill 0.2 pad 0.38, 0.2 pad 0.46)  (78 unrouted)
  Top 0.203: M1.36 41.14,83.31 41.5,83.67 41.5,84.18 41.43,84.3 41.43,84.71 41.4,84.73 | 41.4,84.73 42.21,84.73 M1.87 M1.86 M1.85 M1.75 | v122.94,74.57 123.55,74.57 v126.62,71.04 | TP17.P$1 13.26,88.59 v13.18,87.4 | v2.92,12.7 3.99,12.7 v7.24,9.45 | v14.3,7.44 16.1,7.44 v16.79,8.13 | v26.47,9.02 30.81,8.97 v31.09,9.25 | v37.26,8.61 40.72,10.67 v47.4,11.07 | v51.08,10.62 54.66,10.52 v56.67,10.46 | v58.98,10.41 61.9,10.52 v62.46,10.46 | v65.91,11.25 66.02,11.25 v72.24,10.92 | v81.76,11.07 85.06,11.07 87.22,11.25 | M1.79 M1.82 | M1.1 46.31,83.81 46.23,83.92 46.2,84.12 M1.79 | M1.79 M1.78 M1.74 | M1.80 M1.81 M1.82 | M1.82 M1.84 M1.83 M1.75 | M1.91 M1.92 M1.89 M1.88 M1.76 46,90.48 46,90.81 47.07,91.88 M1.14 | M1.91 M1.90 | M1.93 M1.91 | M1.77 M1.93 | M1.93 M1.94 | M1.94 M1.75 | M1.94 M1.97 M1.96 M1.95 42.17,91.27 | 42.17,91.27 42.32,91.42 42.37,91.89 M1.21 | 41.4,84.73 41.4,85.04 41.35,85.09 | 41.35,85.09 40.89,85.09 M1.33 | M1.32 41.33,85.8 | 41.33,85.8 41.35,85.78 41.35,85.09 | 41.35,86.44 41.28,86.45 M1.31 40.84,86.44 41.35,86.44 | 41.35,86.44 41.35,85.83 41.33,85.8 | M1.30 41.27,87.1 41.33,87.07 | 41.33,87.07 41.33,86.46 41.35,86.44 | 41.33,87.07 41.33,87.73 41.28,87.75 M1.29 41.33,87.76 41.33,88.39 41.34,88.4 | M1.28 41.34,88.4 | M1.27 41.33,89.05 | 41.33,89.05 41.33,88.42 41.34,88.4 | M1.26 41.29,89.7 41.33,89.69 41.33,89.05 | M1.23 40.89,91.88 41.48,91.29 41.68,91.29 41.71,91.31 M1.22 41.7,91.31 41.66,91.26 42.16,91.26 42.17,91.27
  Top 0.254: v62.41,91.69 v63.02,93.95
  Top 0.305: LED7.C 50.91,95.95 52.12,97.16 56.49,97.16 | 56.49,97.16 64.14,97.16 v63.48,96.16 | v56.49,95.53 56.49,97.16
  Top 0.406: M1.23 40.62,92.98
  Top 0.61: G2.P$1 24.05,96.88 23.55,96.37 23.62,96.37 24.16,96.9
  Bottom 0.203: TP15.P$1 122.25,75.26 v122.94,74.57 | v126.62,71.04 127.08,69.65 v127.38,67.97 | TP19.P$1 2.64,12.98 v2.92,12.7 | v7.24,9.45 12.29,9.45 v14.3,7.44 | v16.79,8.13 23.32,8.13 v26.47,9.02 | v31.09,9.25 36.63,9.25 v37.26,8.61 | v47.4,11.07 48.51,11.07 v51.08,10.62 | v56.67,10.46 57.53,10.44 v58.98,10.41 | v62.46,10.46 64.77,10.46 v65.91,11.25 | v72.24,10.92 80.44,10.92 v81.76,11.07
  Bottom 0.254: U10.P$5 11.25,48.78 11.25,46.66 12.11,46.69 C14.2 | C15.2 16.87,50.67 R2.P$2 | J3.5_GND 61.29,89.53 61.29,90.45 61.39,90.55 61.59,91.03 v62.41,91.69 | v63.02,93.95 62.97,94 61.77,94 U6.P$2
  Bottom 0.305: R12.P$2 C6.2 | C2.2 33.5,49.08 R1.P$2 | R18.P$2 52.42,47.56 C8.2 | C4.2 73.05,54.41 R6.P$2 | C10.2 114.58,56.34 R27.P$2 | C13.2 135.53,56.62 R33.P$2 | 63.07,94 v63.02,93.95 | C20.2 56.46,95.5 v56.49,95.53 | U9.12 13.56,86.03 13.31,86.28 13.31,87.27 v13.18,87.4
  pour Bottom: 0.67,98.55 141.2,98.95 141.33,1.51 0.79,1.1
  pour Top: 140.74,98.3 140.84,0.86 41.83,0.56 40.34,0.86 0.97,0.94 0.97,98.07 24.74,97.99 24.74,81.41 40.26,81.41 40.26,81.13 40.26,98.45
LTE_RESET_X
  Top 0.406: TP1.P$1 104.96,93.39 U$1.P$1 106.49,92.56 106.66,92.28 107.04,92 106.91,91.44 107.31,90.47 107.31,86.84 106.05,85.52 105.89,84.78 105.81,84.7 arc45 105.72,84.48 105.72,70.41 102.73,67.43 arc45 102.64,67.2 102.64,62.56 101.91,61.83 arc-45 101.68,61.73 J1.P$2
N$1  (1 unrouted)
N$2  (via drill 0.2 pad 0.46)  (1 unrouted)
  Top 0.305: v91.24,60.83 91.24,68.07 91.97,68.81 91.97,76.15 89.81,78.31 89.33,78.31 BAT1.P1
  Bottom 0.305: U4.P$9 88.94,58.92 89.59,59.56 89.97,59.56 v91.24,60.83
  Bottom 0.61: D9.2_A 95.56,78.31 89.33,78.31 BAT1.P1
N$3  (via drill 0.2 pad 0.46)
  Top 0.254: v12.04,47.57 12.04,47.14 12.62,46.56 16.31,46.56 v16.46,46.71
  Bottom 0.254: U10.P$4 12.61,48.09 12.45,47.93 12.39,47.93 v12.04,47.57 | v16.46,46.71 16.46,47.46 C15.1
N$4  (via drill 0.2 pad 0.46)
  Top 0.254: v11.99,54.41 15.47,54.41 v16.31,53.57
  Bottom 0.254: U10.P$7 12.61,53.79 v11.99,54.41 | v16.31,53.57 R2.P$1
N$5
  Top 0.254: R8.P$2 12.55,86.87 12.52,87.25 12.52,88 LED1.A
N$7  (via drill 0.2 pad 0.46)
  Top 0.203: M1.16 45.6,93.91 TP11.P$1
  Top 0.254: v96.65,64.01 96.65,68.07 arc45 96.55,68.29 94.94,69.9 94.94,71.55 arc-45 95.04,71.77 95.61,72.34 95.61,73.1 arc-45 95.7,73.32 v96.77,74.4 | v62.71,74.42 62.71,78.2 arc-45 62.81,78.43 68.63,84.25 68.63,89.71 arc45 68.54,89.93 v66.98,91.49
  Bottom 0.254: J1.P$5 arc-45 100.54,55.73 97.03,55.73 95.8,56.95 arc-45 95.71,57.18 R41.P$1 96.41,63.91 arc45 96.64,64 v96.65,64.01 | v96.77,74.4 62.77,74.4 arc-45 v62.71,74.42 | v66.98,91.49 62.07,92.84 arc-45 61.85,92.93 U6.P$3
  Bottom 0.305: U6.P$3 61.74,92.89 58.22,90.81 52.58,90.75 51.79,91.54 51.79,92.94 50.65,94.08 45.77,94.08 TP11.P$1
N$8  (via drill 0.2 pad 0.46)
  Top 0.305: v78.44,60.17 v78.36,58.06
  Bottom 0.305: U7.1 78.72,57.32 78.95,57.55 | 78.95,57.55 R26.P$2 | Q3.1 79.27,61.03 v78.44,60.17 | v78.36,58.06 78.95,57.55
N$9  (via drill 0.2 pad 0.46)
  Top 0.203: Q1.4 9,92.97 R42.P$1 9.53,92.61 9.6,92.69
  Top 0.254: 9.6,92.69 28.91,92.69 29.64,93.42 35.38,93.42 v36.02,95.07
  Top 0.305: v82.17,77.57 82.17,65.1 v82.25,65.02
  Bottom 0.254: v36.02,95.07 52.05,95.07 52.65,95.1 53.03,95.17 54.3,96.11 R40.P$1 | 98.73,65.2 96.07,65.2 arc45 95.84,65.11 R41.P$2
  Bottom 0.305: R40.P$1 60.25,96.65 61.7,96.16 61.7,94.98 U6.P$1 67.93,93.59 70,91.52 70,83.41 74.68,78.74 81,78.74 v82.17,77.57 | v82.25,65.02 82.42,65.02 82.9,64.54
  Bottom 0.406: Q3.4 81.87,63.66 82.9,64.54 83.67,65.2 98.73,65.2 J1.P$1
N$10  (1 unrouted)
N$11  (1 unrouted)
N$12
  Bottom 0.305: Q3.6 80.93,61.08 80.62,61.39 80.62,62.36 80.09,62.89 79.36,62.89 Q3.3 77.63,62.98 R25.P$2
N$13  (via drill 0.2 pad 0.46)  (1 unrouted)
  Top 0.305: v70.66,58.12 70.66,64.03 66.93,67.77 66.93,75.74 BAT1.P2
  Bottom 0.305: U3.P$9 69.92,56.48 70.28,56.84 70.28,57.73 v70.66,58.12
  Bottom 0.406: 97.94,78.31 97.74,78.31 96.67,77.24 92.1,77.24 91.36,76.5 71.83,76.5 BAT1.P2
  Bottom 0.61: D10.2_A 97.94,78.31
N$14  (via drill 0.2 pad 0.46)  (1 unrouted)
  Top 0.305: v31.62,51.82 31.62,51.08 32.21,50.49 32.26,50.55 33.55,50.55 34.04,51.03 34.04,61.42 32.05,63.4 31.6,63.4 28.55,66.45 28.55,73.13 31.16,75.74 BAT1.P4
  Bottom 0.305: U1.P$9 31,51.42 31.45,51.87 31.57,51.87 v31.62,51.82
  Bottom 0.406: 96.59,73.28 38.45,73.28 33.17,78.56 BAT1.P4
  Bottom 0.61: D12.2_A 96.59,73.28
N$15  (via drill 0.2 pad 0.46)  (5 unrouted)
  Top 0.254: v43.89,43.71 v48.77,38.84
  Top 0.305: v62.41,43.81 v65.18,41.05 | v104.06,48.01 v108.51,43.56 | v87.99,44.98 v82.88,43.59
  Top 0.406: TP2.P$1 75.87,96.67 75.87,95.71 76.16,94.66 R24.P$2 76.63,92.48 76.99,91.54 | 78.44,84.3 82.4,80.01 82.78,78.97 83.08,79.02 82.96,78.66 83.03,78.26 83.03,47.68 v82.91,47.3
  Bottom 0.254: U10.P$2 13.61,48.14 13.89,47.85 13.89,46.77 C14.1 | 31.77,45.26 31.77,43.81 31.88,43.71 v43.89,43.71 | v48.77,38.84 51.03,38.84 51.56,39.37 51.56,40.71 C7.1 51.74,43.81 50.37,45.19 50.32,45.19 50.27,45.24 50.27,45.96 U5.P$2 | U4.P$2 88.94,52.2 89.66,51.49 89.66,48.04 C5.1 | C9.1 111.11,49.97 112.27,51.13 112.27,53.06 111.35,53.06 110.87,53.54 110.87,54.41 U2.P$2
  Bottom 0.305: U1.P$2 31,45.63 31.06,45.57 31.47,45.57 31.77,45.26 31.77,43.53 C1.1 | 51.74,43.81 v62.41,43.81 | v65.18,41.05 69.32,41.05 69.98,41.71 C3.1 | C3.1 69.97,46.07 71.32,47.42 71.27,49.05 71.2,49.48 70.71,49.71 69.9,50.52 69.9,51.22 U3.P$2 | 89.66,51.49 89.66,48.11 89.76,48.01 v104.06,48.01 | v108.51,43.56 112.47,43.56 112.7,43.79 112.7,46.91 | 112.7,46.91 111.18,48.44 111.18,49.87 C9.1 | C5.1 88.99,45.99 v87.99,44.98 | v82.88,43.59 70.22,44.98 C3.1 | 112.7,46.91 130.25,46.91 131.65,48.31 131.65,49.54 C11.1 132.33,50.23 132.33,52.88 131.87,53.35 U8.P$2
  Bottom 0.406: v82.91,47.3 83.01,45.24 v82.88,43.59
N$16
  Top 0.254: R45.P$2 LED7.A
N$17
  Top 0.406: TP5.P$1 92.75,90.43 U$2.3_ALT
N$18  (via drill 0.2 pad 0.46)
  Top 0.305: v33.2,45.31 33.2,44.21 32.8,44.01 30.5,44.01 v30.2,44.01
  Bottom 0.305: U1.P$4 30,44.21 v30.2,44.01 | v33.2,45.31 33.2,46.16 C2.1
N$19
  Top 0.254: LED4.A 9.96,88.06 9.37,87.48 R14.P$2
N$20
  Bottom 0.305: U1.P$7 30,51.94 30.54,53.37 32.77,53.37 33.2,52.14 R1.P$1
N$21
  Top 0.305: LED2.A R3.P$2
N$22  (via drill 0.2 pad 0.46)
  Top 0.254: LED4.C 9.96,89.74 10.06,89.64 10.46,89.64 v10.82,89.23 | v12.95,71.68 12.95,59.46 12.93,59.46 12.98,59.41 v12.98,58.24
  Bottom 0.254: v10.82,89.23 10.77,86.28 11.46,85.6 11.46,84.61 12.88,83.19 12.88,71.75 v12.95,71.68 | U10.P$1 15,48.78 15.19,48.97 15.19,56.03 v12.98,58.24
N$23  (via drill 0.2 pad 0.46)
  Top 0.305: v32.44,51.54 32.44,51.74 33.05,52.35 33.05,56.19 32.26,56.97 32.26,59.84 v32.26,60.45 32.26,60.53 | LED2.C 24.89,86.08 23.95,85.14 23.9,85.14 21.84,83.08 21.84,81.81 25.6,78.05 25.6,64.16 v28.7,61.06
  Bottom 0.305: U1.P$1 32.13,46.41 32.41,46.69 32.41,51.51 v32.44,51.54 | v28.7,61.06 31.65,61.06 v32.26,60.45
N$24  (via drill 0.2 pad 0.46)
  Top 0.305: v30.91,44.86 30.91,62.71 27.69,65.94 27.69,79.12 29.41,80.85 29.41,85.22 28.65,85.98 27.31,85.98 LED8.C
  Bottom 0.305: U1.P$3 30.5,45.27 v30.91,44.86
N$25
  Bottom 0.305: 29.57,38.99 27.53,41.02 27.53,49.11 R4.P$2 27.83,49.4 28.32,49.4 28.7,49.78 28.7,50.7 28.81,50.81 U1.P$6
  Bottom 0.406: 29.57,38.99 R5.2
N$26  (via drill 0.2 pad 0.46)  (1 unrouted)
  Top 0.305: v110.84,62.75 v109.32,64.26
  Top 0.61: v108.84,67.64 108.94,76.12 BAT2.P2
  Bottom 0.305: U2.P$9 v110.84,62.75 | v109.32,64.26 109.32,67.16 v108.84,67.64
  Bottom 0.61: 98.6,69.19 D7.2_A 98.58,67.79 v108.84,67.64
N$27  (via drill 0.2 pad 0.46)
  Top 0.254: v13.13,47.55 13.13,50.8 10.16,53.77 10.16,65.81 7.42,68.56 7.42,71.09 6.6,71.91 6.6,84.4 7.54,85.34 7.54,86.28 8.08,86.82 8.08,87.05 8.76,87.73 8.76,90.55 9.27,91.06 10.96,91.06 LED1.C
  Bottom 0.254: U10.P$3 13.11,47.57 v13.13,47.55
N$28  (via drill 0.2 pad 0.46)
  Top 0.305: v69.27,47.55 73.91,47.55 75.23,48.87 75.23,50.9 v74.83,51.31
  Bottom 0.305: U3.P$4 68.92,47.9 v69.27,47.55 | v74.83,51.31 C4.1
N$29  (via drill 0.2 pad 0.46)
  Top 0.305: v68.45,56.95 71.98,56.95 v72.21,56.72
  Bottom 0.305: U3.P$7 68.92,56.48 v68.45,56.95 | v72.21,56.72 72.21,56.32 R6.P$1
N$30
  Top 0.305: LED3.A R7.P$2
N$31
  Bottom 0.254: U10.P$6 11.29,53.18 10.72,52.6 10.72,51.44 10.21,50.93 9.53,50.93 R20.P$2 9.45,44.15 10.31,43.28 11.53,43.28
  Bottom 0.406: 11.53,43.28 R29.2
N$32
  Top 0.305: LED5.A R9.P$2
N$33  (1 unrouted)
N$34  (via drill 0.2 pad 0.46)
  Top 0.254: LED5.C 72.58,86.75 66.78,80.95 65.66,77.8 63.83,74.8 63.83,48.39 65.76,46.46 73.08,46.46 v73.3,46.69
  Bottom 0.254: v73.3,46.69 73.3,48.92 71.12,51.1 70.55,51.1 U3.P$1
N$35  (via drill 0.2 pad 0.46)
  Top 0.254: LED3.C 75,86.85 75.87,85.98 75.87,81.13 75.04,80.93
  Top 0.305: v70.26,48.74 67.51,48.74 67.51,58.42 65.3,63.02 65.33,66.4 65.33,74.65 68.17,81 75.04,80.93 74.78,80.97
  Bottom 0.305: U3.P$3 69.42,49.58 v70.26,48.74
N$36
  Bottom 0.305: U3.P$6 67.78,55.63 67.59,55.45 67.59,54.28 67.46,54.15 66.93,54.15 | 66.93,54.15 66.67,54.15 R10.P$2 | 66.93,54.15 66.8,54.03 66.8,49.07 65.43,47.7 65.43,46.86 | 65.48,46.84 65.43,46.86 | 65.43,46.86 65.38,46.9 65.37,46.89 R11.2
N$38  (via drill 0.2 pad 0.46)
  Top 0.305: v110.08,51.56 114.28,51.56 v116.08,53.37
  Bottom 0.305: U2.P$4 109.84,51.81 v110.08,51.56 | v116.08,53.37 115,53.37 C10.1
N$39  (via drill 0.2 pad 0.46)
  Top 0.254: v88.27,49.86 92.73,49.86 94.39,51.51 94.39,52.65 v94.18,52.86
  Bottom 0.254: U4.P$4 87.94,50.18 v88.27,49.86 | v94.18,52.86 91.7,52.86 C6.1
N$40  (via drill 0.2 pad 0.46)
  Top 0.254: v87.45,59.28 91.36,59.28 v91.57,59.08
  Bottom 0.254: U4.P$7 87.94,58.79 v87.45,59.28 | v91.57,59.08 91.57,57.29 R12.P$1
N$41
  Top 0.305: LED6.A R13.P$2
N$42  (via drill 0.2 pad 0.46)  (1 unrouted)
  Top 0.305: v104.06,71.6 96.52,71.6 v96.44,71.53 | BAT2.P1 132.21,83.44 136.73,78.92 136.73,69.37 v131.04,63.68
  Bottom 0.305: U8.P$9 131.87,63.45 | 131.87,63.45 131.87,63.81 130.96,64.72 117.45,64.72 112.52,69.65 106.02,69.65 v104.06,71.6 | v96.44,71.53 98.7,71.53 D8.2_A | v131.04,63.68 131.64,63.68 131.87,63.45
  Bottom 0.61: D8.2_A 97.41,71.48
N$43
  Top 0.305: LED9.A R15.P$2
N$44  (via drill 0.2 pad 0.46)  (2 unrouted)
  Top 0.254: J2.P$1 102.46,2.13 102.21,2.39 102.21,4.45 102.39,4.62 105.13,4.62 J2.P$2 102.44,4.67 102.36,4.75 102.36,43.66 96.47,49.55 96.47,55.73 92.15,60.05 90.83,60.05 v87.55,63.32
  Top 0.305: M1.15 46.25,92.73 46.66,93.14 53.67,93.14 v53.7,93.17 | v87.55,63.32 87.55,67.06 v87.2,67.41 | v61.19,72.31 61.19,81.13 | 61.19,81.13 60.88,81.99 62.2,84.23 62.2,86.16 J3.1_VREF | v56.41,92.96 62.18,94.89 64.26,94.69 64.82,90.73 66.85,89.69 66.85,84.45 64.44,81.1 61.21,81.1 61.19,81.13
  Bottom 0.305: v53.7,93.17 54.71,93.17 54.76,93.12 | 54.76,93.12 54.76,93.96 C20.1 | 54.76,93.12 54.85,93.03 R34.1 54.85,93.1 54.86,93.12 56.26,93.12 v56.41,92.96 | 87.14,62.91 v87.55,63.32 | v87.2,67.41 77.29,67.41 72.39,72.31 v61.19,72.31
N$45  (via drill 0.2 pad 0.46)
  Top 0.254: v90.5,48.84 87.53,48.84 84.1,52.27 84.1,60.4 84.15,60.45 84.15,77.44 90.73,84.02 90.73,84.58 91.92,85.78 92.56,85.78 LED9.C
  Bottom 0.254: U4.P$1 89.44,52.7 90.53,51.61 90.53,48.87 v90.5,48.84
N$46  (via drill 0.2 pad 0.46)
  Top 0.254: 94.19,85.87 LED6.C 94.29,85.95 94.72,85.95 95.3,85.37 95.3,81.18 94.92,80.8 88.72,80.8 85.85,77.93 85.85,60.45 85.83,60.43 85.83,52.2 87,51.03 v88.77,51.03
  Bottom 0.254: U4.P$3 88.44,51.36 v88.77,51.03
N$47
  Bottom 0.254: U4.P$6 87.24,57.57 86.49,56.82 86.49,56.31 86.21,56.03 R16.P$2 85.64,52.34 84.1,50.8 84.1,49.88
  Bottom 0.305: 84.1,49.88 84.1,48.98 R17.2
N$48
  Bottom 0.203: U9.15 12.32,87.98 R43.P$2
N$49  (via drill 0.2 pad 0.46)
  Top 0.254: v109.25,60.66 113.44,60.66 v113.59,59.89
  Bottom 0.254: U2.P$7 109.84,60.6 v109.25,60.66 | v113.59,59.89 113.67,58.52 R27.P$1
N$50
  Top 0.305: LED13.A R28.P$2
N$51  (via drill 0.2 pad 0.46)
  Top 0.305: v49.66,43 53.09,43 54.08,43.99 54.08,45.87 v54.03,45.92
  Bottom 0.305: U5.P$4 49.22,43.44 v49.66,43 | v54.03,45.92 52.76,45.92 C8.1
N$52
  Bottom 0.305: U5.P$7 49.22,52.96 49.81,53.54 52.96,53.54 53.52,52.98 53.52,50.52 53.31,50.32 52.7,50.32 R18.P$1
N$53
  Top 0.305: LED10.A R19.P$2
N$54  (1 unrouted)
N$55
  Top 0.305: LED12.A R21.P$2
N$56  (1 unrouted)
N$57  (via drill 0.2 pad 0.46)
  Top 0.254: v53.01,56.03 53.01,56.59 45.41,64.19 45.41,77.27 49.91,81.18 49.91,84.63 LED12.C
  Bottom 0.254: U5.P$1 50.72,45.75 51.89,44.58 54.2,44.58 55.14,45.52 55.14,53.9 v53.01,56.03
N$58  (via drill 0.2 pad 0.46)
  Top 0.254: v50.29,44.17 50.29,47.83 56.59,54.13 56.59,79.96 54.61,81.94 54.63,86.82 54.18,87.27 53.14,86.31 LED10.C
  Bottom 0.254: U5.P$3 49.72,44.74 v50.29,44.17
N$59
  Bottom 0.305: U5.P$6 48.38,50.41 47.88,49.91 47.88,49.2 | 47.88,49.2 47.62,48.95 46.99,48.95 R22.P$2 | 47.88,49.2 47.85,49.2 47.27,48.62 47.27,42.99 R23.2
N$60  (via drill 0.2 pad 0.46)
  Top 0.254: v60.33,30.18 60.33,68.94 58.34,70.92 58.34,75.13 59.46,77.29 59.46,80.42 59.21,80.59 58.14,81.99 56.9,84.23 56.82,89.59 59.46,91.14 61.34,91.14 61.32,89.61 J3.6_SWO
  Bottom 0.254: J2.P$13 120.42,2.72 119.2,3.76 119.2,10.79 116.97,13.21 105.05,13.21 95.48,22.78 67.72,22.78 v60.33,30.18
N$61
  Top 0.305: LED15.A R30.P$2
N$63  (via drill 0.2 pad 0.46)
  Top 0.305: v113.18,49.89 110.26,49.89 107.57,52.58 107.57,64.67 110.69,67.79 111.58,67.79 115.29,71.5 115.29,84.12 113.64,85.78 111.58,85.78 111.02,86.33 111.02,90.27 111.56,90.81 112.13,90.81 LED15.C
  Bottom 0.305: U2.P$1 112.06,54.44 113.31,53.19 113.31,50.01 v113.18,49.89
N$64  (via drill 0.2 pad 0.46)
  Top 0.305: v110.87,52.45 109.12,52.45 108.25,53.31 108.25,64.11 111.45,67.31 112.32,67.31 116.2,71.2 116.2,89.26 114.48,90.98 113.93,90.98 LED13.C
  Bottom 0.305: U2.P$3 110.34,52.98 v110.87,52.45
N$65
  Bottom 0.254: U2.P$6 108.6,58.84 108.1,58.34 108.1,57.38 107.72,57 106.83,57 R31.P$2 106.66,48.51 109.02,46.15 109.42,45.82
  Bottom 0.305: 109.02,46.15 109.02,46.14 R32.2
N$66  (1 unrouted)
N$67  (via drill 0.2 pad 0.46)  (1 unrouted)
  Top 0.305: v52.25,51.66 52.6,51.66 55.19,54.25
  Top 0.406: 55.19,54.25 55.19,73.84 54.13,74.91 | 54.13,74.91 BAT1.P3 | v55.65,74.91 54.13,74.91
  Bottom 0.305: U5.P$9 50.22,51.19 50.65,51.61 52.2,51.61 v52.25,51.66
  Bottom 0.406: 96.63,75.44 56.41,75.44 v55.65,74.91
  Bottom 0.61: D11.2_A 96.63,75.44
N$68  (via drill 0.2 pad 0.46)
  Top 0.305: v130.89,51.38 134.62,51.38 v135.25,52.02
  Bottom 0.305: U8.P$4 130.87,51.4 v130.89,51.38 | v135.25,52.02 135.25,52.72 C13.1
N$69  (via drill 0.2 pad 0.46)
  Top 0.305: v130.25,61.01 134.67,61.01 v135.28,60.4
  Bottom 0.305: U8.P$7 130.87,60.39 v130.25,61.01 | v135.28,60.4 R33.P$1
N$70
  Top 0.305: LED16.A R35.P$2
N$71
  Top 0.305: LED17.A R36.P$2
N$72
  Top 0.305: LED18.A R37.P$2
N$73  (via drill 0.2 pad 0.46)
  Top 0.305: v74.65,96.16 74.65,96.1 LED17.C
  Bottom 0.305: U8.P$10 132.37,64.79 131.62,65.53 118.59,65.53 113.69,70.43 107.7,70.43 105.59,72.54 105.59,81.94 102.08,85.45 102.08,92.58 98.42,96.24 74.73,96.24 v74.65,96.16
N$74  (via drill 0.2 pad 0.46)
  Top 0.305: LED18.C 125.26,91.02 124.26,90.02 124.26,83.24 128.07,79.43 128.07,62.33 128.14,62.26 128.14,52.27 130.18,50.24 133.4,50.24 v133.63,50.47
  Bottom 0.305: v133.63,50.47 133.63,52.72 U8.P$1
N$75  (via drill 0.2 pad 0.46)
  Top 0.305: LED16.C 128,91 128.45,90.55 128.45,80.31 128.98,79.78 128.98,62.38 129.36,62 129.36,53.49 130.23,52.63 v131.55,52.63
  Bottom 0.305: U8.P$3 131.37,52.81 v131.55,52.63
N$76
  Bottom 0.305: U8.P$6 129.63,58.38 129.39,58.14 129.39,57.17 129.13,56.92 R38.P$2 128.07,53.14 127.48,52.55 127.48,52.08 R46.2
N$77
  Top 0.305: LED8.A R65.P$2
N$78
  Top 0.305: M1.35 M1.34
N$79  (via drill 0.2 pad 0.38, 0.2 pad 0.46)
  Top 0.203: v43.97,83.92 43.97,83.82 43.71,83.57 43.71,83.27 M1.40
  Top 0.254: v45.39,81.08 48.64,81.08 v48.67,81.05 | v61.42,33.91 61.42,70.81 61.9,71.3 61.9,79.76 v61.92,80.14
  Bottom 0.254: v43.97,83.92 43.97,82.5 v45.39,81.08 | v48.67,81.05 61.92,81.05 | 61.92,81.05 64.29,81.05 66.45,84.15 66.45,86.16 65.86,86.74 62.87,86.74 J3.3_RST | J2.P$15 122.96,2.62 121.69,3.73 121.69,10.54 117.68,14.71 106.15,14.71 96.27,24.59 70.74,24.59 v61.42,33.91 | v61.92,80.14 61.92,81.05
N$80  (via drill 0.2 pad 0.38, 0.2 pad 0.46)
  Top 0.203: v42.93,83.87 42.88,83.82 42.57,83.36 42.42,83.07 M1.38
  Top 0.254: v43.31,80.67 43.84,80.67 44.91,81.74 49,81.74 v49.23,81.97 | v39.01,40.49 39.01,73.69 v43.31,77.98
  Bottom 0.254: v42.93,83.87 42.93,81.05 v43.31,80.67 v43.31,77.98 | v49.23,81.97 60.17,81.97 60.35,82.37 60.38,86.36 J3.2_DIO | J2.P$7 112.8,2.56 111.56,3.66 111.56,5.56 109.96,7.32 106.45,7.32 93.93,19.84 59.66,19.84 v39.01,40.49
N$81  (via drill 0.2 pad 0.38, 0.2 pad 0.46)
  Top 0.203: v42.14,83.87 41.83,83.38 M1.37
  Top 0.254: v55.37,85.06 55.37,82.04 v57.35,80.21 57.61,79.65 57.61,53.49 57,52.88 v57,28.55 | v47.65,80.03 42.01,80.03 41.55,80.49 41.55,81.25 v41.58,81.28
  Bottom 0.254: J3.4_CLK 60.66,87.58 59.82,86.74 57.3,86.74 v55.37,85.06 | v57.35,80.21 47.95,80.34 v47.65,80.03 | v41.58,81.28 41.58,83.31 v42.14,83.87 | J2.P$9 115.34,2.52 114.1,3.66 114.1,5.23 110.69,8.74 106.98,8.74 94.56,21.16 64.39,21.16 v57,28.55
N$82
  Top 0.406: J5.P$1 13.08,95.12 Q1.5 10.01,95.35 10.06,95.4 10.06,96.22 9.96,96.32 9.01,96.32 Q1.6 9,97.07 8.74,97.33 6.83,97.33 6.53,97.03 6.53,96.33 Q1.1 5.52,96.3 5.49,96.27 5.49,95.53 5.56,95.45 6.39,95.45 Q1.2
N$83  (via drill 0.2 pad 0.46)
  Top 0.203: v15.98,87.83 15.98,85.93 v15.77,82.09
  Top 0.305: v57.73,91.9 57.17,90.88 55.12,88.82 55.12,87.15 56.08,85.9 56.08,84.53 56.21,84.05 56.49,82.17 57.48,81.18 57.99,80.7 58.47,80.19 v58.47,79.4 58.47,79.38
  Bottom 0.203: R43.P$1 12.63,88.64 U9.16 15.18,88.64 v15.98,87.83 | v15.77,82.09 19.96,79.58 27.56,80.06
  Bottom 0.305: R40.P$2 58.66,95.26 U6.P$5 56.73,91.88 R34.2 56.9,91.88 v57.73,91.9 | v58.47,79.4 57.73,79.38 54.38,76.02 43.84,76.02 40.82,79.05 34.59,79.05 33.25,80.39 27.89,80.39 27.56,80.06
N$84  (1 unrouted)
N$85
  Top 0.305: M1.24 40.24,91.05 39.83,91.47 G2.P$3
N$86
  Top 0.203: M1.18 44.3,94.77
  Top 0.254: 44.3,94.77 44.3,94.8 45.54,96.04 46.63,96.04 R45.P$1
N$87
  Top 0.406: J5.P$2 15.59,97.26 TP20.P$1
N$88  (via drill 0.2 pad 0.46)
  Top 0.203: M1.12 48.59,90.35 TP12.P$1
  Top 0.406: v52.58,96.24 53.44,95.41 arc45 53.53,95.18 54.94,93.78 54.94,92.36 arc-45 54.85,92.13 54.51,91.8 49.81,91.8 arc45 49.59,91.7 TP12.P$1
  Bottom 0.203: TP21.P$1 25.07,89.92 25.15,90.02
  Bottom 0.406: J5.P$5 21.59,92.08 25.15,90.02 | TP21.P$1 25.57,89.89 arc45 25.8,89.98 32.03,96.22 52.45,96.22 arc45 52.67,96.31 v52.58,96.24
N$89
  Top 0.203: M1.9 50.64,88.4 TP9.P$1
N$90
  Top 0.203: M1.6 48.47,86.45 TP10.P$1
N$91  (via drill 0.2 pad 0.46)  (1 unrouted)
  Top 0.406: v72.8,63.75 72.8,74.95 v79.65,80.11
  Bottom 0.254: U10.P$9 13.61,55.58 11.48,57.71 11.48,66.34 6.5,71.32 6.5,80.11 BAT3.P1
  Bottom 0.406: 11.48,66.34 44.17,66.34 46.97,63.55 72.59,63.55 v72.8,63.75 | v79.65,80.11 80.8,80.75 82.53,80.64 95.17,80.64 97.51,82.98 99.08,82.98 D1.2_A
N$92  (1 unrouted)
N$93  (3 unrouted)
N$95  (3 unrouted)
PI_PWRC  (via drill 0.2 pad 0.46)
  Top 0.203: M1.20 43,93.95 TP13.P$1
  Top 0.254: v17.75,90.63 14.61,90.63 13.03,92.2 10.39,92.2 10.01,91.82 7.87,91.82 7.7,92 7.7,92.48 R42.P$2
  Top 0.406: Q1.3 6.5,93.68 R42.P$2
  Bottom 0.254: TP13.P$1 42.82,93.93 34.9,93.93 29.72,88.75 24.82,88.75 23.88,87.81 23.16,87.81 22.34,88.64 U9.1 19.75,88.64 v17.75,90.63
RXFRMLRW
  Top 0.203: M1.10 49,89.05 TP6.P$1
  Bottom 0.203: U9.4 21.98,86.69 R44.P$2
  Bottom 0.254: R44.P$2 23.88,86.46 25.15,87.73 25.7,87.73 TP22.P$1 46,87.71 48.01,89.71 49.48,89.71 TP6.P$1
RXFRMPI
  Bottom 0.203: U9.9 12.94,84.08 12.32,84.71 12.32,86.36 11.43,87.43 11.43,89.56 11.99,90.91 15.52,90.91 17.68,92.46 17.68,94.53 J5.P$3
RXFRMPILRW  (via drill 0.2 pad 0.46)
  Top 0.203: 16.28,73.41 15.39,75.92 13.11,84.73 v13.08,84.91
  Top 0.254: J1.P$3 97.95,59.73 arc-45 97.73,59.83 94.72,62.84 94.72,67.38 arc45 94.62,67.61 v94.61,67.61 | v16.64,71.07 16.64,72.99 arc45 16.54,73.21 16.3,73.45 16.24,73.51
  Top 0.305: 16.28,73.41 16.28,73.43 16.3,73.45
  Bottom 0.203: R44.P$1 22.01,87.33 U9.3 20.17,87.35 18.47,87.35 16.5,85.39 U9.11 13.48,85.37 v13.08,84.91
  Bottom 0.254: v94.61,67.61 91.34,67.61 arc45 91.12,67.52 90.17,66.57 46.59,66.57 arc-45 46.36,66.67 45.29,67.74 33.89,67.74 arc45 33.66,67.65 33.5,67.49 20.35,67.49 arc-45 20.12,67.58 v16.64,71.07
TXTOLRW  (via drill 0.2 pad 0.46)
  Top 0.203: M1.8 48.82,87.75 TP7.P$1
  Top 0.254: 44.58,79.12 44.58,62.67 arc45 44.67,62.44 v46.18,60.94 | v92.2,66.45 92.2,61.4 arc45 92.3,61.17 95.68,57.78 100.43,57.78 arc-45 J1.P$4
  Top 0.305: 44.58,79.12 34.21,79.12 v31.98,81.36
  Bottom 0.203: U9.7 21.46,84.73 21.87,84.33 21.87,83.92 TP23.P$1 27.46,83.8 32.18,84.63
  Bottom 0.254: 32.18,84.63 37.74,84.81 41.07,86.18 46.56,87.2 TP7.P$1 | v46.18,60.94 72.54,60.94 arc45 72.76,61.03 76.71,64.97 80.82,64.97 arc45 81.04,65.07 82.32,65.96 91.97,65.96 arc45 92.14,66.39 v92.2,66.45
  Bottom 0.305: v31.98,81.36 26.82,81.36 26.06,82.12 TP23.P$1
TXTOPI  (via drill 0.2 pad 0.46)
  Top 0.203: v21.61,85.52 22.96,87.43 23.09,87.55 v23.32,88.65
  Bottom 0.203: U9.5 21.1,86.03 v21.61,85.52 | v23.32,88.65 19.81,92.15 19.81,94.39 J5.P$4
VCC1  (via drill 0.2 pad 0.46)
  Top 0.254: R14.P$1 R8.P$1 11.68,86.54 12.27,85.78 14.22,85.78 14.86,85.32 14.86,81.1 15.21,80.75 20.8,80.75 v20.83,80.72 | v25.22,80.82 25.22,81.69 R3.P$1
  Top 0.305: R3.P$1 R65.P$1 27.76,82.12 arc45 27.99,82.22 v28.45,82.68 | R13.P$1 R15.P$1 92.57,81.89 v90.7,81.89 | R35.P$1 R37.P$1 | R28.P$1 R30.P$1 | v31.93,52.58 v31.9,54.53 | v50.6,52.5 v50.6,54.97 | v52.09,83.26 52.09,83.04 arc-45 52,82.82 51.71,82.53 | v68.83,81.61 69.99,82.77 R9.P$1 R7.P$1 74.71,82.87 74.6,82.75 74.6,81.99 v74.68,81.92 | v55.83,76.15 55.83,79.63 R19.P$1 51.21,82.47 R21.P$1 | R36.P$1 73.03,89.97 v69.24,86.18
  Top 0.406: 51.71,82.53 51.22,82.53 R21.P$1 | 74.28,82.92 74.46,82.9 73.49,82.9 R9.P$1 | 93.86,81.95 93.91,81.98 92.74,81.98 R15.P$1 | TP4.P$1 78.46,96.54 78.46,95.5 77.61,94.66 R24.P$1 80.93,97.92 95.17,97.92 95.17,88.32 96.77,86.11 96.75,80.06 | 96.75,80.06 92.96,67.18 93.04,66.93 v93.37,66.62 93.32,66.57 v93.24,62.66 | v12.12,55.7 19.81,55.73 v20.78,55.73 | 96.75,80.06 v96.75,85.52 | v100.69,86.16 104.44,86.16 v104.78,86.49 | v115.09,86.16 115.09,86.77 114.68,87.17 113.92,87.17 R28.P$1 | R37.P$1 125.91,85.52 v125.78,85.39
  Bottom 0.254: R20.P$1 9.45,53.87 10.77,55.19 12.93,55.19 13.01,55.12 | 13.01,55.12 13.08,55.04 | 13.08,55.04 13.08,53.2 U10.P$8 13.11,55.02 13.08,55.04 | 13.01,55.12 12.65,55.12 12.55,55.22 12.55,55.27 v12.12,55.7 | v20.83,80.72 25.12,80.72 v25.22,80.82 | U4.P$8 88.44,60.27 88.21,60.5 86.28,60.5 85.67,59.89 85.67,58 85.64,57.97 | U2.P$8 110.34,61.77 110.21,61.9 109.93,62.18
  Bottom 0.305: 85.64,57.97 R16.P$1 | U1.P$8 30.5,51.48 30.84,52.45 31.95,52.45 v31.93,52.58 | v31.9,54.53 32,54.38 31.8,54.59 | U5.P$8 49.72,52.13 50.04,52.45 50.55,52.45 v50.6,52.5 | v50.6,54.97 50.39,54.97 46.1,54.99 45.7,54.59 | U3.P$8 69.42,59.08 69.47,59.13 | 85.67,59.89 80.22,59.89 R26.P$1 78.9,59.02 77.75,59.51 77.75,60.3 77.85,60.86 | 77.85,60.86 77.37,60.86 | 77.37,60.86 76.86,60.86 U7.3 | R25.P$1 77.35,60.88 77.37,60.86 | Q3.2 78.64,62.03 78.18,61.57 78.18,61.19 77.85,60.86 | U8.P$8 131.37,61.49 130.91,61.95 128.91,61.95 128.07,61.11 | v28.45,82.68 39.34,82.68 arc45 39.56,82.77 41.68,84.89 47.19,84.89 arc-45 47.41,84.79 49.23,82.98 51.68,82.98 arc45 51.91,83.08 v52.09,83.26 | v55.83,76.15 56.67,76.99 58.73,76.99 60.48,78.74 64.31,78.74 66.32,81.61 v68.83,81.61 69.24,82.02 v69.24,86.18 | v74.68,81.92 90.68,81.92
  Bottom 0.406: 26.7,53.54 26.7,51.35 R4.P$1 | R22.P$1 46.92,53.36 45.7,54.59 31.8,54.59 27.74,54.59 26.7,53.54 | 26.7,53.54 22.96,53.54 v20.78,55.73 | v50.6,54.97 50.6,55.27 52.98,57.66 63.37,57.66 65.38,59.66 65.76,59.66 66.42,59 66.42,55.36 R10.P$1 66.62,58.86 66.34,59.13 69.47,59.13 72.92,59.13 73.03,59.23 75.23,59.23 U7.3 | 109.93,62.18 107.57,62.18 106.76,61.37 106.76,58.14 R31.P$1 106.81,64.62 104.88,66.55 93.45,66.55 v93.37,66.62 | 88.21,60.5 89.51,61.32 v93.24,62.66 | R38.P$1 128.07,61.11 127,62.18 109.98,63.63 110.21,61.9 | D9.1_K 101.31,82.92 D1.1_K | D10.1_K 101.06,85.66 | 101.06,85.66 100.61,86.11 96.52,86.11 | 96.52,86.11 91.85,86.11 90.68,84.94 90.68,81.92 v90.7,81.89 | v96.75,85.52 96.75,85.88 96.52,86.11 | 101.06,85.66 101.06,85.78 v100.69,86.16 | v104.78,86.49 114.76,86.49 v115.09,86.16 115.85,85.39 v125.78,85.39
  Bottom 0.61: D12.1_K 101.56,73.71 101.65,73.72 101.6,73.85 | 101.37,78.25 101.21,75.97 101.24,76.09 101.76,76.02 D11.1_K 101.6,75.86 101.6,73.85 | 101.37,78.25 101.12,78.3 D10.1_K | D9.1_K 101.25,78.22 101.62,77.7 | 101.62,77.7 101.37,78.25 | 101.6,73.85 101.93,73.68 | D8.1_K 101.04,69.6 100.94,71.02 D7.1_K 101.65,73.61 101.62,77.7

### Text on the board
Top: Add USB-A Connector for power | Move thermistors away from charging IC | Add 2-pin conn for pwr to Main
tFinish: POS | POS | POS | NEG | NEG